# EAGLE schematic SuperLongboard-Lite 1.3.0 (EAGLE 9.7.0), part 1 of 2

## Sheet 1 of 12: MCU
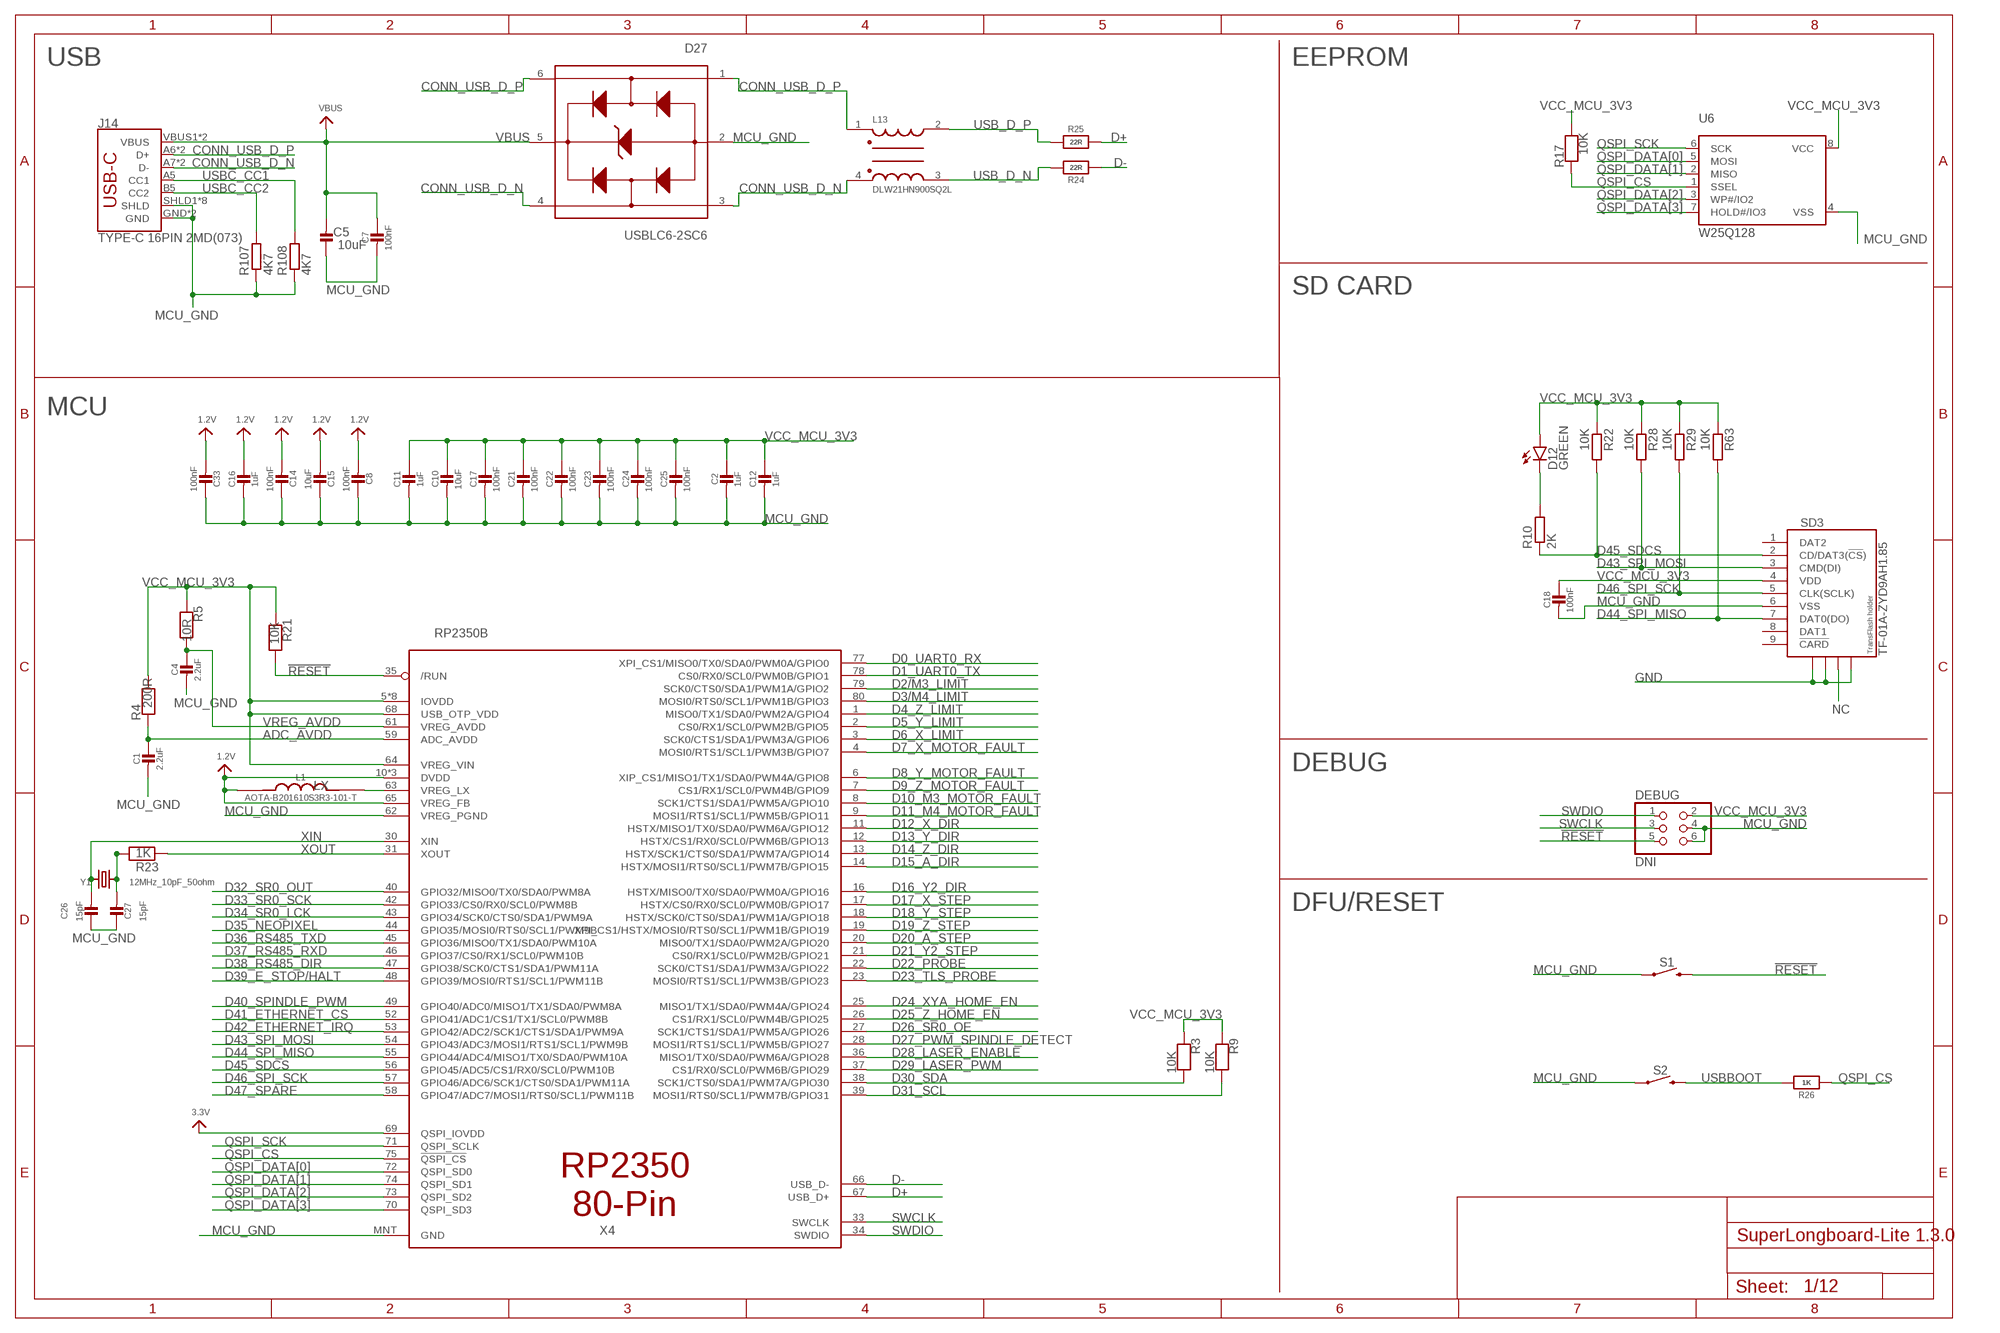
[diagram p0: schematic, sheet 1]

### Parts
C1  2.2uF  CAP_CERAMIC0603_NO  [0603-NO]
C2  1uF  CAP_CERAMIC0603_NO  [0603-NO]
C4  2.2uF  CAP_CERAMIC0603_NO  [0603-NO]
C5  10uF  CAP_CERAMIC_1206  [_1206]
C7  100nF  CAP_CERAMIC0603_NO  [0603-NO]
C8  100nF  CAP_CERAMIC0603_NO  [0603-NO]
C10  10uF  CAP_CERAMIC_1206  [_1206]
C11  1uF  CAP_CERAMIC0603_NO  [0603-NO]
C12  1uF  CAP_CERAMIC0603_NO  [0603-NO]
C14  100nF  CAP_CERAMIC0603_NO  [0603-NO]
C15  10uF  CAP_CERAMIC_1206  [_1206]
C16  1uF  CAP_CERAMIC0603_NO  [0603-NO]
C17  100nF  CAP_CERAMIC0603_NO  [0603-NO]
C18  100nF  CAP_CERAMIC0603_NO  [0603-NO]
C21  100nF  CAP_CERAMIC0603_NO  [0603-NO]
C22  100nF  CAP_CERAMIC0603_NO  [0603-NO]
C23  100nF  CAP_CERAMIC0603_NO  [0603-NO]
C24  100nF  CAP_CERAMIC0603_NO  [0603-NO]
C25  100nF  CAP_CERAMIC0603_NO  [0603-NO]
C26  15pF  CAP_CERAMIC0603_NO  [0603-NO]
C27  15pF  CAP_CERAMIC0603_NO  [0603-NO]
C33  100nF  CAP_CERAMIC0603_NO  [0603-NO]
D12  GREEN  LEDCHIP-LED0805  [CHIP-LED0805]
D27  USBLC6-2SC6  [SOT95P280X145-6N]
DEBUG  DNI  PINHD-2X3  [2X03]
J14  TYPE-C 16PIN 2MD(073)  USB_C16PIN  [USB-C-16P]
L1  AOTA-B201610S3R3-101-T  INDUCTOR-0806  [INDUCTOR-0806]
L13  DLW21HN900SQ2L  [FIL_DLW21HN900SQ2L]
R3  10K  RESISTOR_0603_NOOUT  [0603-NO]
R4  200R  RESISTOR_0603_NOOUT  [0603-NO]
R5  10R  RESISTOR_0603_NOOUT  [0603-NO]
R9  10K  RESISTOR_0603_NOOUT  [0603-NO]
R10  2K  R-EU_R0603  [R0603]
R17  10K  RESISTOR_0603  [_0603]
R21  10K  RESISTOR_0603  [_0603]
R22  10K  R-EU_R0603  [R0603]
R23  1K  RESISTOR_0603  [_0603]
R24  22R  RESISTOR_0603_NOOUT  [0603-NO]
R25  22R  RESISTOR_0603_NOOUT  [0603-NO]
R26  1K  RESISTOR_0603  [_0603]
R28  10K  R-EU_R0603  [R0603]
R29  10K  R-EU_R0603  [R0603]
R63  10K  R-EU_R0603  [R0603]
R107  4K7  R-EU_R0603  [R0603]
R108  4K7  R-EU_R0603  [R0603]
S1  ZX-QC36-4.3TPWD  MOMENTARY-SWITCH-SPST-SMD-6.0X3.5MM  [TACTILE_SWITCH_SMD_6.0X3.5MM]
S2  ZX-QC36-4.3TPWD  MOMENTARY-SWITCH-SPST-SMD-6.0X3.5MM  [TACTILE_SWITCH_SMD_6.0X3.5MM]
SD3  TF-01A-ZYD9AH1.85  TF-HOLDER  [TF-PULL]
U6  W25Q128  SPIFLASH_8PIN208MIL  [SOIC8_208MIL]
X4  RP2350B  [QFN80]
Y1  12MHz_10pF_50ohm  CRYSTAL3.2X2.5  [CRYSTAL_3.2X2.5]

### Nets
1.2V: C8.2 C14.2 C15.2 C16.1 C33.2 L1.1 X4.10(DVDD) X4.32(DVDD) X4.51(DVDD) X4.65(VREG_FB)
!RESET: DEBUG.5 R21.2 S1.2 X4.35(/RUN)
ADC_AVDD: C1.1 R4.1 X4.59(ADC_AVDD)
CONN_USB_D_N: D27.3(I/O2_IN) D27.4(I/O2_OUT) J14.A7(D-) J14.B7(D-) L13.4
CONN_USB_D_P: D27.1(I/O1_IN) D27.6(I/O1_OUT) J14.A6(D+) J14.B6(D+) L13.1
D0_UART0_RX: X4.77(XPI_CS1/MISO0/TX0/SDA0/PWM0A/GPIO0) ; also sheet 11
D1_UART0_TX: X4.78(CS0/RX0/SCL0/PWM0B/GPIO1) ; also sheet 11
D2/M3_LIMIT: X4.79(SCK0/CTS0/SDA1/PWM1A/GPIO2) ; also sheet 4
D3/M4_LIMIT: X4.80(MOSI0/RTS0/SCL1/PWM1B/GPIO3) ; also sheet 4
D4_Z_LIMIT: X4.1(MISO0/TX1/SDA0/PWM2A/GPIO4) ; also sheet 4
D5_Y_LIMIT: X4.2(CS0/RX1/SCL0/PWM2B/GPIO5) ; also sheet 4
D6_X_LIMIT: X4.3(SCK0/CTS1/SDA1/PWM3A/GPIO6) ; also sheet 4
D7_X_MOTOR_FAULT: X4.4(MOSI0/RTS1/SCL1/PWM3B/GPIO7) ; also sheet 3
D8_Y_MOTOR_FAULT: X4.6(XIP_CS1/MISO1/TX1/SDA0/PWM4A/GPIO8) ; also sheet 3
D9_Z_MOTOR_FAULT: X4.7(CS1/RX1/SCL0/PWM4B/GPIO9) ; also sheet 3
D10_M3_MOTOR_FAULT: X4.8(SCK1/CTS1/SDA1/PWM5A/GPIO10) ; also sheet 3
D11_M4_MOTOR_FAULT: X4.9(MOSI1/RTS1/SCL1/PWM5B/GPIO11) ; also sheet 3
D12_X_DIR: X4.11(HSTX/MISO1/TX0/SDA0/PWM6A/GPIO12) ; also sheet 2
D13_Y_DIR: X4.12(HSTX/CS1/RX0/SCL0/PWM6B/GPIO13) ; also sheet 2
D14_Z_DIR: X4.13(HSTX/SCK1/CTS0/SDA1/PWM7A/GPIO14) ; also sheet 2
D15_A_DIR: X4.14(HSTX/MOSI1/RTS0/SCL1/PWM7B/GPIO15) ; also sheet 2
D16_Y2_DIR: X4.16(HSTX/MISO0/TX0/SDA0/PWM0A/GPIO16) ; also sheet 2
D17_X_STEP: X4.17(HSTX/CS0/RX0/SCL0/PWM0B/GPIO17) ; also sheet 2
D18_Y_STEP: X4.18(HSTX/SCK0/CTS0/SDA1/PWM1A/GPIO18) ; also sheet 2
D19_Z_STEP: X4.19(XPI_CS1/HSTX/MOSI0/RTS0/SCL1/PWM1B/GPIO19) ; also sheet 2
D20_A_STEP: X4.20(MISO0/TX1/SDA0/PWM2A/GPIO20) ; also sheet 2
D21_Y2_STEP: X4.21(CS0/RX1/SCL0/PWM2B/GPIO21) ; also sheet 2
D22_PROBE: X4.22(SCK0/CTS1/SDA1/PWM3A/GPIO22) ; also sheet 4
D23_TLS_PROBE: X4.23(MOSI0/RTS1/SCL1/PWM3B/GPIO23) ; also sheet 4
D24_XYA_HOME_EN: X4.25(MISO1/TX1/SDA0/PWM4A/GPIO24) ; also sheet 12
D25_Z_HOME_EN: X4.26(CS1/RX1/SCL0/PWM4B/GPIO25) ; also sheet 12
D26_SR0_OE: X4.27(SCK1/CTS1/SDA1/PWM5A/GPIO26) ; also sheet 11
D27_PWM_SPINDLE_DETECT: X4.28(MOSI1/RTS1/SCL1/PWM5B/GPIO27) ; also sheet 5
D28_LASER_ENABLE: X4.36(MISO1/TX0/SDA0/PWM6A/GPIO28) ; also sheet 9
D29_LASER_PWM: X4.37(CS1/RX0/SCL0/PWM6B/GPIO29) ; also sheet 5
D30_SDA: R3.2 X4.38(SCK1/CTS0/SDA1/PWM7A/GPIO30) ; also sheet 11
D31_SCL: R9.2 X4.39(MOSI1/RTS0/SCL1/PWM7B/GPIO31) ; also sheet 11
D32_SR0_OUT: X4.40(GPIO32/MISO0/TX0/SDA0/PWM8A) ; also sheet 11
D33_SR0_SCK: X4.42(GPIO33/CS0/RX0/SCL0/PWM8B) ; also sheet 11
D34_SR0_LCK: X4.43(GPIO34/SCK0/CTS0/SDA1/PWM9A) ; also sheet 11
D35_NEOPIXEL: X4.44(GPIO35/MOSI0/RTS0/SCL1/PWM9B) ; also sheet 3,11
D36_RS485_TXD: X4.45(GPIO36/MISO0/TX1/SDA0/PWM10A) ; also sheet 6
D37_RS485_RXD: X4.46(GPIO37/CS0/RX1/SCL0/PWM10B) ; also sheet 6
D38_RS485_DIR: X4.47(GPIO38/SCK0/CTS1/SDA1/PWM11A) ; also sheet 6
D39_E_STOP/HALT: X4.48(GPIO39/MOSI0/RTS1/SCL1/PWM11B) ; also sheet 9
D40_SPINDLE_PWM: X4.49(GPIO40/ADC0/MISO1/TX1/SDA0/PWM8A) ; also sheet 5
D41_ETHERNET_CS: X4.52(GPIO41/ADC1/CS1/TX1/SCL0/PWM8B) ; also sheet 11
D42_ETHERNET_IRQ: X4.53(GPIO42/ADC2/SCK1/CTS1/SDA1/PWM9A) ; also sheet 11
D43_SPI_MOSI: R28.2 SD3.3(CMD(DI)) X4.54(GPIO43/ADC3/MOSI1/RTS1/SCL1/PWM9B) ; also sheet 11
D44_SPI_MISO: R63.2 SD3.7(DAT0(DO)) X4.55(GPIO44/ADC4/MISO1/TX0/SDA0/PWM10A) ; also sheet 11
D45_SDCS: R10.1 R22.2 SD3.2(CD/DAT3(!CS!)) X4.56(GPIO45/ADC5/CS1/RX0/SCL0/PWM10B)
D46_SPI_SCK: R29.2 SD3.5(CLK(SCLK)) X4.57(GPIO46/ADC6/SCK1/CTS0/SDA1/PWM11A) ; also sheet 11
D47_SPARE: X4.58(GPIO47/ADC7/MOSI1/RTS0/SCL1/PWM11B) ; also sheet 11
D+: R25.2 X4.67(USB_D+)
D-: R24.2 X4.66(USB_D-)
GND: SD3.S1 SD3.S2 SD3.S4 ; also sheet 2,3,4,6,7,8,9,10,11,12
LX: L1.2 X4.63(VREG_LX)
MCU_GND: C1.2 C2.2 C4.2 C5.1 C7.2 C8.1 C10.2 C11.2 C12.2 C14.1 C15.1 C16.2 C17.2 C18.2 C21.2 C22.2 C23.2 C24.2 C25.2 C26.1 C27.1 C33.1 D27.2(GND) DEBUG.4 DEBUG.6 J14.GND J14.GND2(GND) J14.SHLD1(SHLD) J14.SHLD2(SHLD) J14.SHLD3(SHLD) J14.SHLD4(SHLD) J14.SHLD5(SHLD) J14.SHLD6(SHLD) J14.SHLD7(SHLD) J14.SHLD8(SHLD) R107.1 R108.1 S1.1 S2.1 SD3.6(VSS) U6.4(VSS) X4.62(VREG_PGND) X4.MNT(GND) ; also sheet 2,3,4,5,6,7,8,9,11,12
N$8: D12.C R10.2
N$10: C27.2 R23.1 Y1.2
NC: SD3.S3
QSPI_CS: R17.1 R26.1 U6.1(SSEL) X4.75(!QSPI_CS)
QSPI_DATA[0]: U6.5(MOSI) X4.72(QSPI_SD0)
QSPI_DATA[1]: U6.2(MISO) X4.74(QSPI_SD1)
QSPI_DATA[2]: U6.3(WP#/IO2) X4.73(QSPI_SD2)
QSPI_DATA[3]: U6.7(HOLD#/IO3) X4.70(QSPI_SD3)
QSPI_SCK: U6.6(SCK) X4.71(QSPI_SCLK)
SWCLK: DEBUG.3 X4.33(SWCLK)
SWDIO: DEBUG.1 X4.34(SWDIO)
USB_D_N: L13.3 R24.1
USB_D_P: L13.2 R25.1
USBBOOT: R26.2 S2.2
USBC_CC1: J14.A5(CC1) R108.2
USBC_CC2: J14.B5(CC2) R107.2
VBUS: C5.2 C7.1 D27.5(VBUS) J14.VBUS1(VBUS) J14.VBUS2(VBUS) ; also sheet 8
VCC_MCU_3V3: C2.1 C10.1 C11.1 C12.1 C17.1 C18.1 C21.1 C22.1 C23.1 C24.1 C25.1 D12.A DEBUG.2 R3.1 R4.2 R5.1 R9.1 R17.2 R21.1 R22.1 R28.1 R29.1 R63.1 SD3.4(VDD) U6.8(VCC) X4.5(IOVDD) X4.15(IOVDD) X4.24(IOVDD) X4.29(IOVDD) X4.41(IOVDD) X4.50(IOVDD) X4.60(IOVDD) X4.64(VREG_VIN) X4.68(USB_OTP_VDD) X4.69(QSPI_IOVDD) X4.76(IOVDD) ; supply symbol labelled 3.3V ; also sheet 2,3,4,5,6,7,8,9,11,12
VREG_AVDD: C4.1 R5.2 X4.61(VREG_AVDD)
XIN: C26.2 X4.30(XIN) Y1.1
XOUT: R23.2 X4.31(XOUT)
Unconnected: SD3.1(DAT2) SD3.8(DAT1) SD3.9(!CARD)

### Notes on the sheet
- USB | EEPROM
- SD CARD
- MCU
- DEBUG
- DFU/RESET

## Sheet 2 of 12: MOTOR BUFFERS
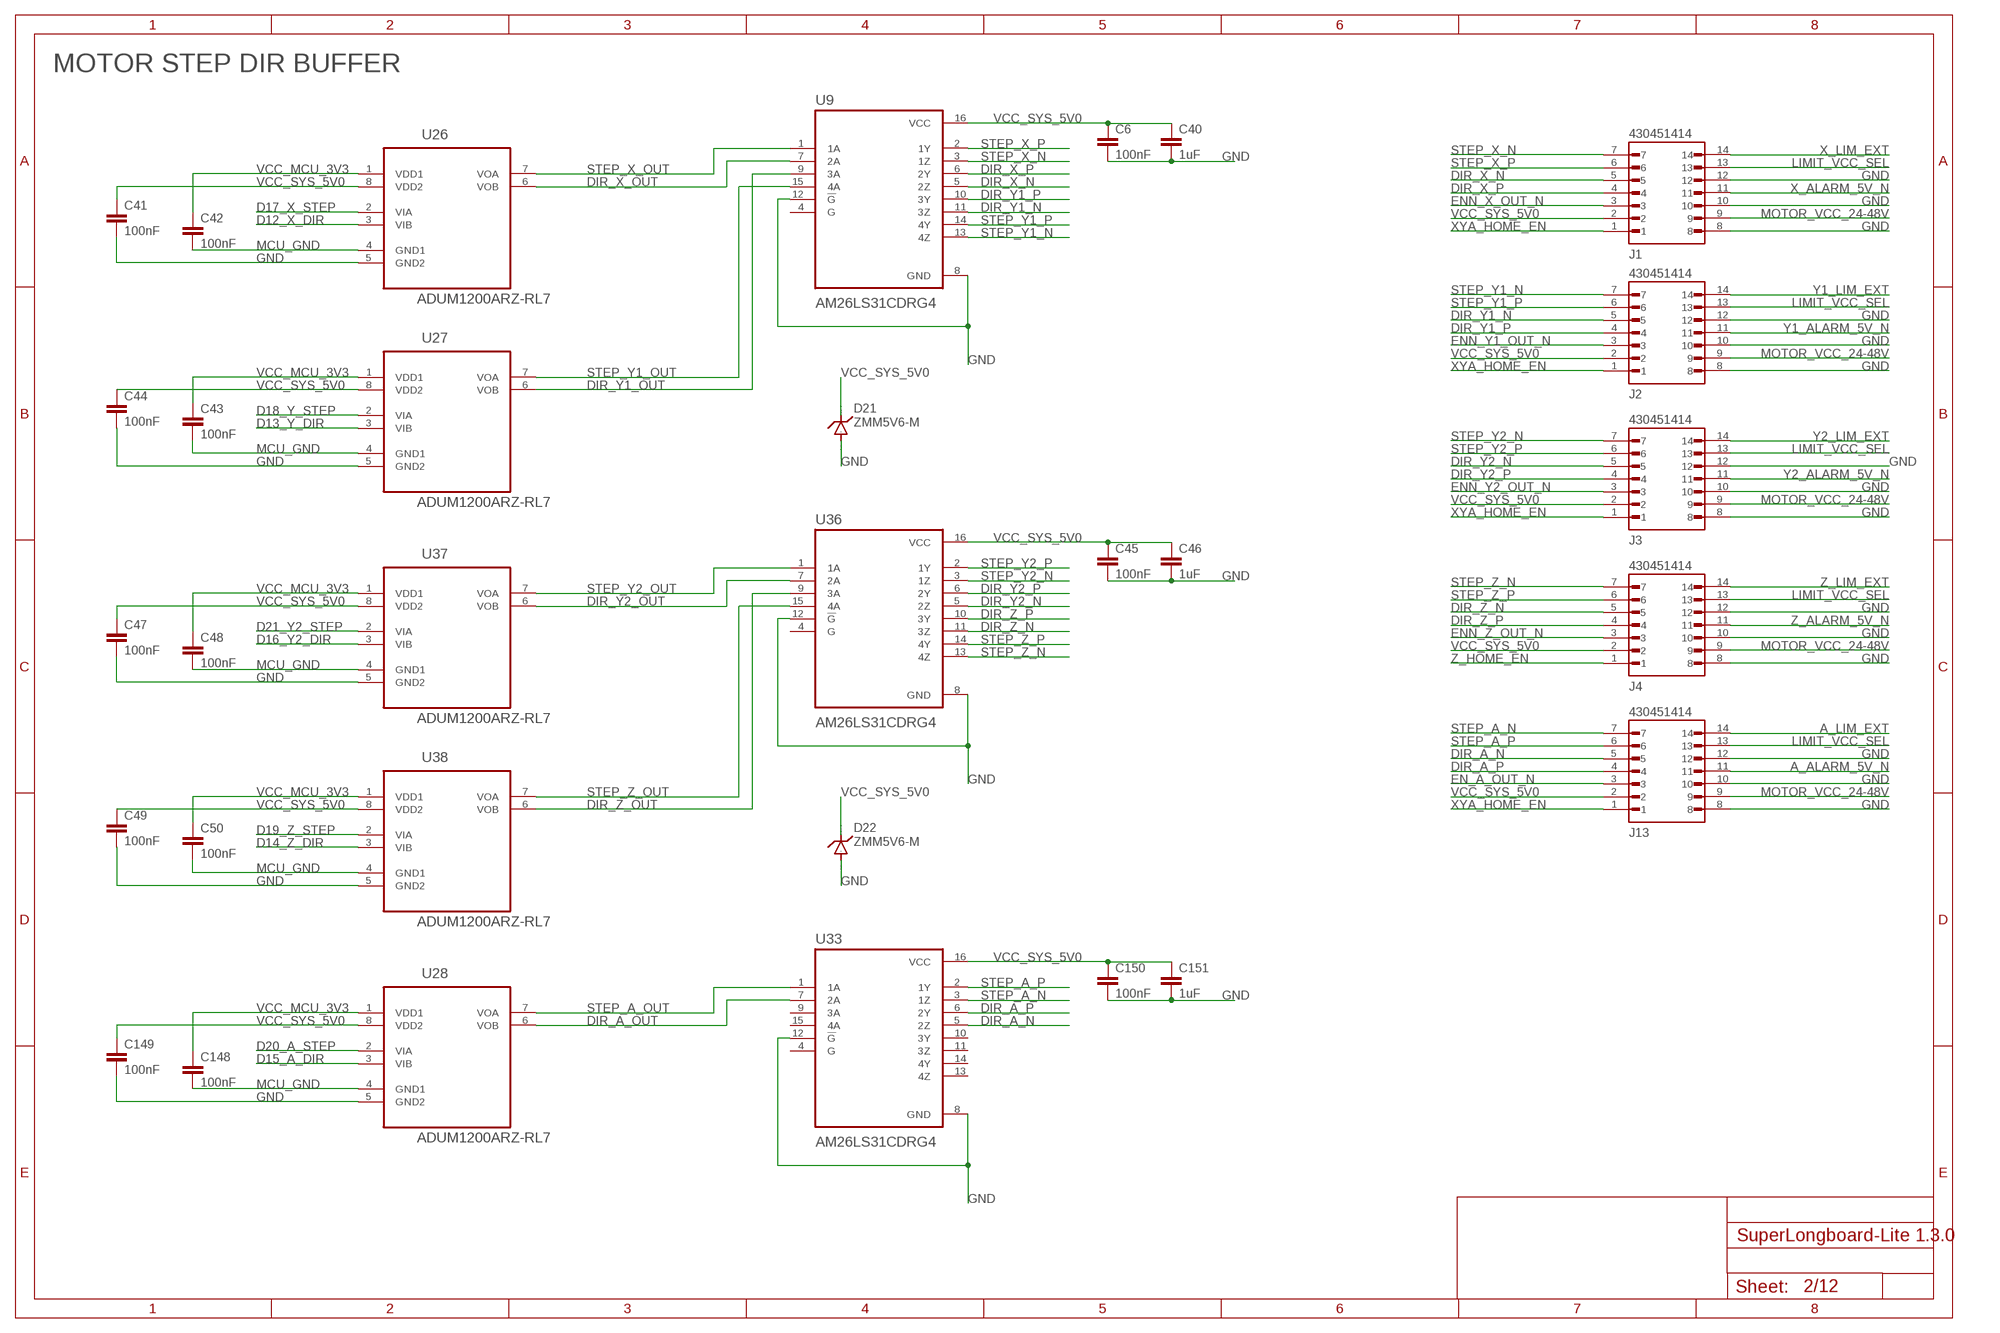
[diagram p1: schematic, sheet 2]

### Parts
C6  100nF  C-EUC0603K  [C0603K]
C40  1uF  C-EUC0603K  [C0603K]
C41  100nF  C-EUC0603K  [C0603K]
C42  100nF  C-EUC0603K  [C0603K]
C43  100nF  C-EUC0603K  [C0603K]
C44  100nF  C-EUC0603K  [C0603K]
C45  100nF  C-EUC0603K  [C0603K]
C46  1uF  C-EUC0603K  [C0603K]
C47  100nF  C-EUC0603K  [C0603K]
C48  100nF  C-EUC0603K  [C0603K]
C49  100nF  C-EUC0603K  [C0603K]
C50  100nF  C-EUC0603K  [C0603K]
C148  100nF  C-EUC0603K  [C0603K]
C149  100nF  C-EUC0603K  [C0603K]
C150  100nF  C-EUC0603K  [C0603K]
C151  1uF  C-EUC0603K  [C0603K]
D21  ZMM5V6-M  DIODE-MINIMELF  [MINIMELF]
D22  ZMM5V6-M  DIODE-MINIMELF  [MINIMELF]
J1  430451414  [MOLEX_430451414]
J2  430451414  [MOLEX_430451414]
J3  430451414  [MOLEX_430451414]
J4  430451414  [MOLEX_430451414]
J13  430451414  [MOLEX_430451414]
U9  AM26LS31CDRG4  AM26LS31CDR  [SOIC127P600X175-16N]
U26  ADUM1200ARZ-RL7  [SOIC127P600X175-8N]
U27  ADUM1200ARZ-RL7  [SOIC127P600X175-8N]
U28  ADUM1200ARZ-RL7  [SOIC127P600X175-8N]
U33  AM26LS31CDRG4  AM26LS31CDR  [SOIC127P600X175-16N]
U36  AM26LS31CDRG4  AM26LS31CDR  [SOIC127P600X175-16N]
U37  ADUM1200ARZ-RL7  [SOIC127P600X175-8N]
U38  ADUM1200ARZ-RL7  [SOIC127P600X175-8N]

### Nets
A_ALARM_5V_N: J13.11 ; also sheet 3
A_LIM_EXT: J13.14 ; also sheet 4
D12_X_DIR: U26.3(VIB) ; also sheet 1
D13_Y_DIR: U27.3(VIB) ; also sheet 1
D14_Z_DIR: U38.3(VIB) ; also sheet 1
D15_A_DIR: U28.3(VIB) ; also sheet 1
D16_Y2_DIR: U37.3(VIB) ; also sheet 1
D17_X_STEP: U26.2(VIA) ; also sheet 1
D18_Y_STEP: U27.2(VIA) ; also sheet 1
D19_Z_STEP: U38.2(VIA) ; also sheet 1
D20_A_STEP: U28.2(VIA) ; also sheet 1
D21_Y2_STEP: U37.2(VIA) ; also sheet 1
DIR_A_N: J13.5 U33.5(2Z)
DIR_A_OUT: U28.6(VOB) U33.7(2A)
DIR_A_P: J13.4 U33.6(2Y)
DIR_X_N: J1.5 U9.5(2Z)
DIR_X_OUT: U9.7(2A) U26.6(VOB)
DIR_X_P: J1.4 U9.6(2Y)
DIR_Y1_N: J2.5 U9.11(3Z)
DIR_Y1_OUT: U9.9(3A) U27.6(VOB)
DIR_Y1_P: J2.4 U9.10(3Y)
DIR_Y2_N: J3.5 U36.5(2Z)
DIR_Y2_OUT: U36.7(2A) U37.6(VOB)
DIR_Y2_P: J3.4 U36.6(2Y)
DIR_Z_N: J4.5 U36.11(3Z)
DIR_Z_OUT: U36.9(3A) U38.6(VOB)
DIR_Z_P: J4.4 U36.10(3Y)
EN_A_OUT_N: J13.3 ; also sheet 3
ENN_X_OUT_N: J1.3 ; also sheet 3
ENN_Y1_OUT_N: J2.3 ; also sheet 3
ENN_Y2_OUT_N: J3.3 ; also sheet 3
ENN_Z_OUT_N: J4.3 ; also sheet 3
GND: C6.2 C40.2 C41.2 C44.2 C45.2 C46.2 C47.2 C49.2 C149.2 C150.2 C151.2 D21.A D22.A J1.8 J1.10 J1.12 J2.8 J2.10 J2.12 J3.8 J3.10 J3.12 J4.8 J4.10 J4.12 J13.8 J13.10 J13.12 U9.8(GND) U9.12(!G) U26.5(GND2) U27.5(GND2) U28.5(GND2) U33.8(GND) U33.12(!G) U36.8(GND) U36.12(!G) U37.5(GND2) U38.5(GND2) ; also sheet 1,3,4,6,7,8,9,10,11,12
LIMIT_VCC_SEL: J1.13 J2.13 J3.13 J4.13 J13.13 ; also sheet 4
MCU_GND: C42.2 C43.2 C48.2 C50.2 C148.2 U26.4(GND1) U27.4(GND1) U28.4(GND1) U37.4(GND1) U38.4(GND1) ; also sheet 1,3,4,5,6,7,8,9,11,12
MOTOR_VCC_24-48V: J1.9 J2.9 J3.9 J4.9 J13.9 ; also sheet 4,7,8,11
STEP_A_N: J13.7 U33.3(1Z)
STEP_A_OUT: U28.7(VOA) U33.1(1A)
STEP_A_P: J13.6 U33.2(1Y)
STEP_X_N: J1.7 U9.3(1Z)
STEP_X_OUT: U9.1(1A) U26.7(VOA)
STEP_X_P: J1.6 U9.2(1Y)
STEP_Y1_N: J2.7 U9.13(4Z)
STEP_Y1_OUT: U9.15(4A) U27.7(VOA)
STEP_Y1_P: J2.6 U9.14(4Y)
STEP_Y2_N: J3.7 U36.3(1Z)
STEP_Y2_OUT: U36.1(1A) U37.7(VOA)
STEP_Y2_P: J3.6 U36.2(1Y)
STEP_Z_N: J4.7 U36.13(4Z)
STEP_Z_OUT: U36.15(4A) U38.7(VOA)
STEP_Z_P: J4.6 U36.14(4Y)
VCC_MCU_3V3: C42.1 C43.1 C48.1 C50.1 C148.1 U26.1(VDD1) U27.1(VDD1) U28.1(VDD1) U37.1(VDD1) U38.1(VDD1) ; also sheet 1,3,4,5,6,7,8,9,11,12
VCC_SYS_5V0: C6.1 C40.1 C41.1 C44.1 C45.1 C46.1 C47.1 C49.1 C149.1 C150.1 C151.1 D21.C D22.C J1.2 J2.2 J3.2 J4.2 J13.2 U9.16(VCC) U26.8(VDD2) U27.8(VDD2) U28.8(VDD2) U33.16(VCC) U36.16(VCC) U37.8(VDD2) U38.8(VDD2) ; also sheet 3,4,6,8,9,10,11,12
X_ALARM_5V_N: J1.11 ; also sheet 3
X_LIM_EXT: J1.14 ; also sheet 4
XYA_HOME_EN: J1.1 J2.1 J3.1 J13.1 ; also sheet 12
Y1_ALARM_5V_N: J2.11 ; also sheet 3
Y1_LIM_EXT: J2.14 ; also sheet 4
Y2_ALARM_5V_N: J3.11 ; also sheet 3
Y2_LIM_EXT: J3.14 ; also sheet 4
Z_ALARM_5V_N: J4.11 ; also sheet 3
Z_HOME_EN: J4.1 ; also sheet 12
Z_LIM_EXT: J4.14 ; also sheet 4
Unconnected: U9.4(G) U33.4(G) U33.9(3A) U33.10(3Y) U33.11(3Z) U33.13(4Z) U33.14(4Y) U33.15(4A) U36.4(G)

### Notes on the sheet
- MOTOR STEP DIR BUFFER

## Sheet 3 of 12: MOTOR BUFFERS
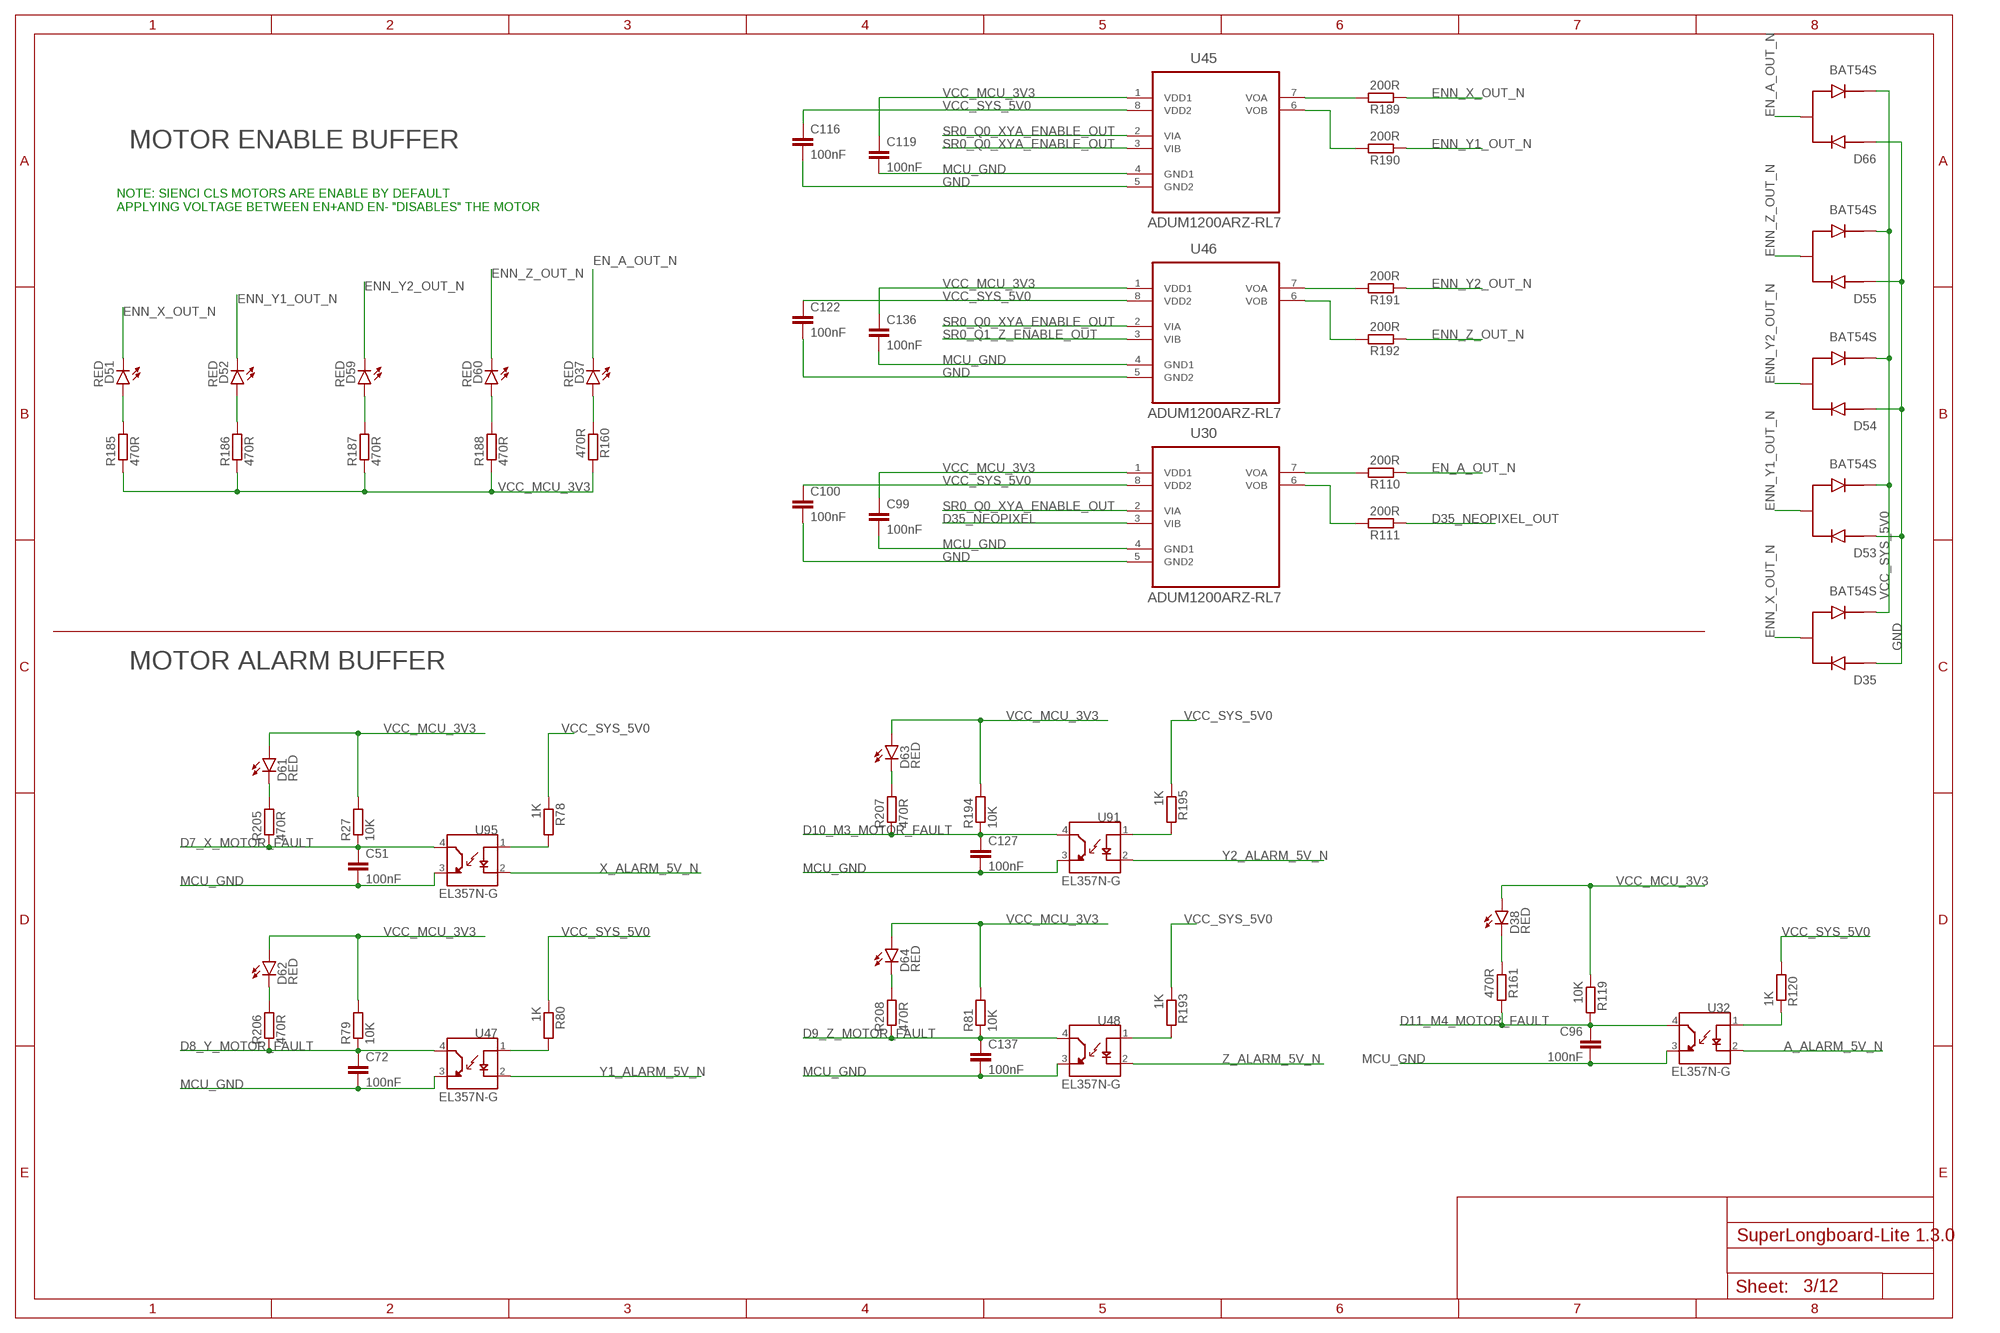
[diagram p2: schematic, sheet 3]

### Parts
C51  100nF  C-EUC0603  [C0603]
C72  100nF  C-EUC0603  [C0603]
C96  100nF  C-EUC0603  [C0603]
C99  100nF  C-EUC0603K  [C0603K]
C100  100nF  C-EUC0603K  [C0603K]
C116  100nF  C-EUC0603K  [C0603K]
C119  100nF  C-EUC0603K  [C0603K]
C122  100nF  C-EUC0603K  [C0603K]
C127  100nF  C-EUC0603  [C0603]
C136  100nF  C-EUC0603K  [C0603K]
C137  100nF  C-EUC0603  [C0603]
D35  BAT54S  [SOT95P240X120-3N]
D37  RED  LEDCHIP-LED0805  [CHIP-LED0805]
D38  RED  LEDCHIP-LED0805  [CHIP-LED0805]
D51  RED  LEDCHIP-LED0805  [CHIP-LED0805]
D52  RED  LEDCHIP-LED0805  [CHIP-LED0805]
D53  BAT54S  [SOT95P240X120-3N]
D54  BAT54S  [SOT95P240X120-3N]
D55  BAT54S  [SOT95P240X120-3N]
D59  RED  LEDCHIP-LED0805  [CHIP-LED0805]
D60  RED  LEDCHIP-LED0805  [CHIP-LED0805]
D61  RED  LEDCHIP-LED0805  [CHIP-LED0805]
D62  RED  LEDCHIP-LED0805  [CHIP-LED0805]
D63  RED  LEDCHIP-LED0805  [CHIP-LED0805]
D64  RED  LEDCHIP-LED0805  [CHIP-LED0805]
D66  BAT54S  [SOT95P240X120-3N]
R27  10K  R-EU_R0603  [R0603]
R78  1K  R-EU_R0603  [R0603]
R79  10K  R-EU_R0603  [R0603]
R80  1K  R-EU_R0603  [R0603]
R81  10K  R-EU_R0603  [R0603]
R110  200R  R-EU_R0603  [R0603]
R111  200R  R-EU_R0603  [R0603]
R119  10K  R-EU_R0603  [R0603]
R120  1K  R-EU_R0603  [R0603]
R160  470R  R-EU_R0603  [R0603]
R161  470R  R-EU_R0603  [R0603]
R185  470R  R-EU_R0603  [R0603]
R186  470R  R-EU_R0603  [R0603]
R187  470R  R-EU_R0603  [R0603]
R188  470R  R-EU_R0603  [R0603]
R189  200R  R-EU_R0603  [R0603]
R190  200R  R-EU_R0603  [R0603]
R191  200R  R-EU_R0603  [R0603]
R192  200R  R-EU_R0603  [R0603]
R193  1K  R-EU_R0603  [R0603]
R194  10K  R-EU_R0603  [R0603]
R195  1K  R-EU_R0603  [R0603]
R205  470R  R-EU_R0603  [R0603]
R206  470R  R-EU_R0603  [R0603]
R207  470R  R-EU_R0603  [R0603]
R208  470R  R-EU_R0603  [R0603]
U30  ADUM1200ARZ-RL7  [SOIC127P600X175-8N]
U32  EL357N-G  [OPTO_EL357N-G]
U45  ADUM1200ARZ-RL7  [SOIC127P600X175-8N]
U46  ADUM1200ARZ-RL7  [SOIC127P600X175-8N]
U47  EL357N-G  [OPTO_EL357N-G]
U48  EL357N-G  [OPTO_EL357N-G]
U91  EL357N-G  [OPTO_EL357N-G]
U95  EL357N-G  [OPTO_EL357N-G]

### Nets
A_ALARM_5V_N: U32.2(C) ; also sheet 2
D7_X_MOTOR_FAULT: C51.1 R27.1 R205.1 U95.4(CT) ; also sheet 1
D8_Y_MOTOR_FAULT: C72.1 R79.1 R206.1 U47.4(CT) ; also sheet 1
D9_Z_MOTOR_FAULT: C137.1 R81.1 R208.1 U48.4(CT) ; also sheet 1
D10_M3_MOTOR_FAULT: C127.1 R194.1 R207.1 U91.4(CT) ; also sheet 1
D11_M4_MOTOR_FAULT: C96.1 R119.2 R161.2 U32.4(CT) ; also sheet 1
D35_NEOPIXEL: U30.3(VIB) ; also sheet 1,11
D35_NEOPIXEL_OUT: R111.1 ; also sheet 10
EN_A_OUT_N: D37.C D66.3 R110.1 ; also sheet 2
ENN_X_OUT_N: D35.3 D51.C R189.1 ; also sheet 2
ENN_Y1_OUT_N: D52.C D53.3 R190.1 ; also sheet 2
ENN_Y2_OUT_N: D54.3 D59.C R191.1 ; also sheet 2
ENN_Z_OUT_N: D55.3 D60.C R192.1 ; also sheet 2
GND: C100.2 C116.2 C122.2 D35.1 D53.1 D54.1 D55.1 D66.1 U30.5(GND2) U45.5(GND2) U46.5(GND2) ; also sheet 1,2,4,6,7,8,9,10,11,12
MCU_GND: C51.2 C72.2 C96.2 C99.2 C119.2 C127.2 C136.2 C137.2 U30.4(GND1) U32.3(ET) U45.4(GND1) U46.4(GND1) U47.3(ET) U48.3(ET) U91.3(ET) U95.3(ET) ; also sheet 1,2,4,5,6,7,8,9,11,12
N$1: R189.2 U45.7(VOA)
N$3: R190.2 U45.6(VOB)
N$4: R191.2 U46.7(VOA)
N$5: R192.2 U46.6(VOB)
N$7: D62.C R206.2
N$9: R78.2 U95.1(A)
N$11: D61.C R205.2
N$12: R80.2 U47.1(A)
N$13: D63.C R207.2
N$14: R195.2 U91.1(A)
N$15: D64.C R208.2
N$16: R193.2 U48.1(A)
N$17: D51.A R185.2
N$18: D52.A R186.2
N$21: D37.A R160.1
N$23: D60.A R188.2
N$24: D59.A R187.2
N$66: R110.2 U30.7(VOA)
N$69: R111.2 U30.6(VOB)
N$72: R120.1 U32.1(A)
N$92: D38.C R161.1
SR0_Q0_XYA_ENABLE_OUT: U30.2(VIA) U45.2(VIA) U45.3(VIB) U46.2(VIA) ; also sheet 9
SR0_Q1_Z_ENABLE_OUT: U46.3(VIB) ; also sheet 9
VCC_MCU_3V3: C99.1 C119.1 C136.1 D38.A D61.A D62.A D63.A D64.A R27.2 R79.2 R81.2 R119.1 R160.2 R185.1 R186.1 R187.1 R188.1 R194.2 U30.1(VDD1) U45.1(VDD1) U46.1(VDD1) ; also sheet 1,2,4,5,6,7,8,9,11,12
VCC_SYS_5V0: C100.1 C116.1 C122.1 D35.2 D53.2 D54.2 D55.2 D66.2 R78.1 R80.1 R120.2 R193.1 R195.1 U30.8(VDD2) U45.8(VDD2) U46.8(VDD2) ; also sheet 2,4,6,8,9,10,11,12
X_ALARM_5V_N: U95.2(C) ; also sheet 2
Y1_ALARM_5V_N: U47.2(C) ; also sheet 2
Y2_ALARM_5V_N: U91.2(C) ; also sheet 2
Z_ALARM_5V_N: U48.2(C) ; also sheet 2

### Notes on the sheet
- MOTOR ENABLE BUFFER
- NOTE: SIENCI CLS MOTORS ARE ENABLE BY DEFAULT 
  APPLYING VOLTAGE BETWEEN EN+AND EN- "DISABLES" THE MOTOR
- MOTOR ALARM BUFFER

## Sheet 4 of 12: LIMITS, PROBE, AUX
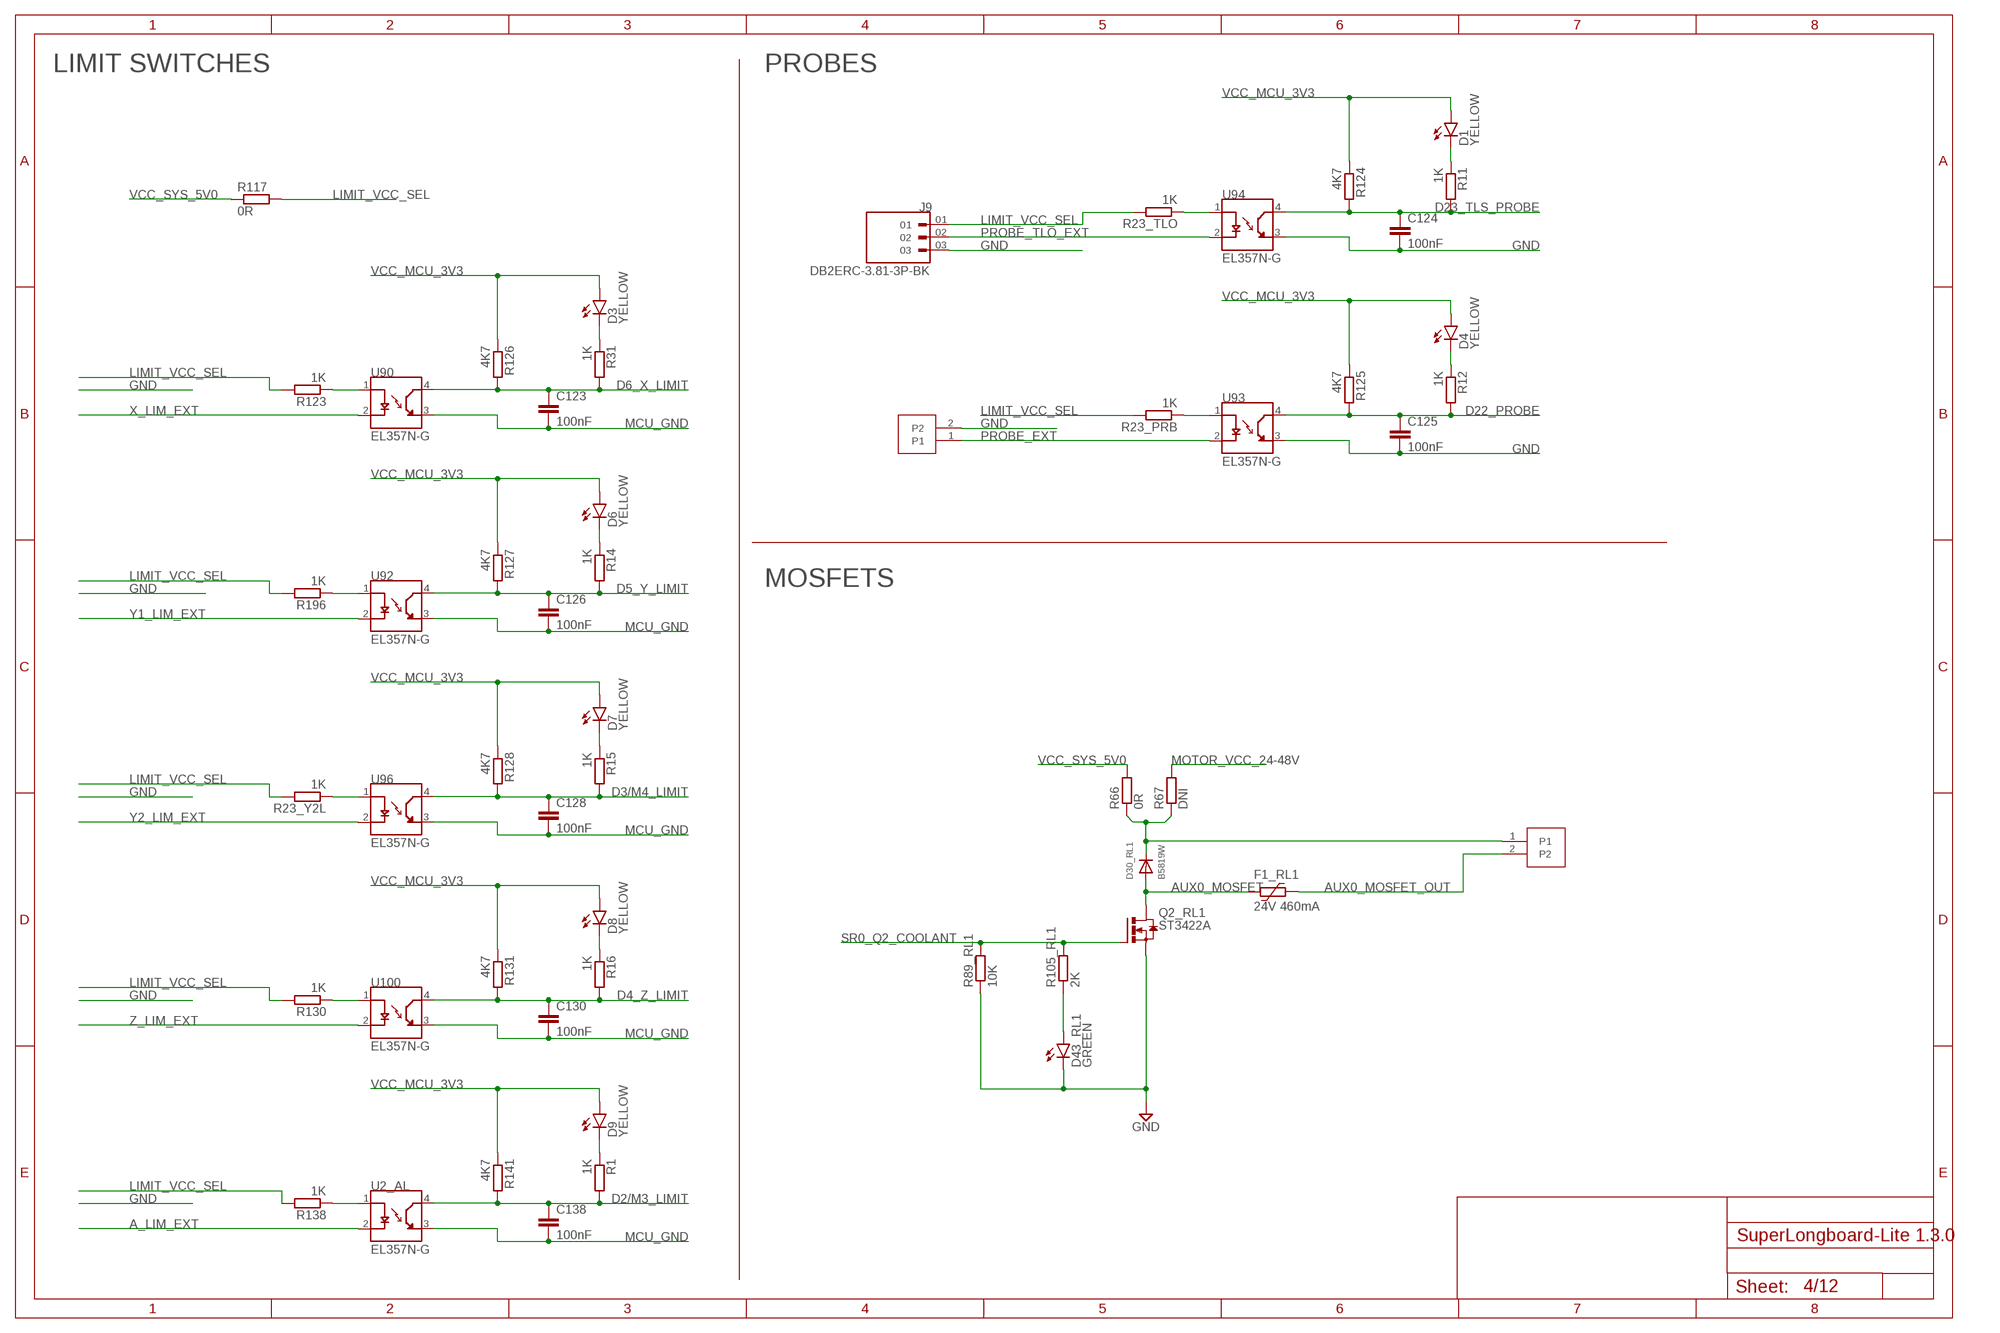
[diagram p3: schematic, sheet 4]

### Parts
C123  100nF  C-EUC0603  [C0603]
C124  100nF  C-EUC0603  [C0603]
C125  100nF  C-EUC0603  [C0603]
C126  100nF  C-EUC0603  [C0603]
C128  100nF  C-EUC0603  [C0603]
C130  100nF  C-EUC0603  [C0603]
C138  100nF  C-EUC0603  [C0603]
D1  YELLOW  LEDCHIP-LED0805  [CHIP-LED0805]
D3  YELLOW  LEDCHIP-LED0805  [CHIP-LED0805]
D4  YELLOW  LEDCHIP-LED0805  [CHIP-LED0805]
D6  YELLOW  LEDCHIP-LED0805  [CHIP-LED0805]
D7  YELLOW  LEDCHIP-LED0805  [CHIP-LED0805]
D8  YELLOW  LEDCHIP-LED0805  [CHIP-LED0805]
D9  YELLOW  LEDCHIP-LED0805  [CHIP-LED0805]
D30_RL1  B5819W  [SOD123FL]
D43_RL1  GREEN  LEDCHIP-LED0805  [CHIP-LED0805]
F1_RL1  24V 460mA  1206L050  [1206L]
J9  DB2ERC-3.81-3P-BK  1803280  [PHOENIX_1803280]
J12  DB2ERC-3.81-2P-BK  1803277  [MC1.5/2-G-3.81]
J17  DB2ERC-3.81-2P-BK  1803277  [MC1.5/2-G-3.81]
Q2_RL1  ST3422A  [SOT-23]
R1  1K  R-EU_R0603  [R0603]
R11  1K  R-EU_R0603  [R0603]
R12  1K  R-EU_R0603  [R0603]
R14  1K  R-EU_R0603  [R0603]
R15  1K  R-EU_R0603  [R0603]
R16  1K  R-EU_R0603  [R0603]
R23_PRB  1K  R-EU_R0603  [R0603]
R23_TLO  1K  R-EU_R0603  [R0603]
R23_Y2L  1K  R-EU_R0603  [R0603]
R31  1K  R-EU_R0603  [R0603]
R66  0R  R-EU_R0603  [R0603]
R67  DNI  R-EU_R0603  [R0603]
R89_RL1  10K  R-EU_R0603  [R0603]
R105_RL1  2K  R-EU_R0603  [R0603]
R117  0R  R-EU_R0603  [R0603]
R123  1K  R-EU_R0603  [R0603]
R124  4K7  R-EU_R0603  [R0603]
R125  4K7  R-EU_R0603  [R0603]
R126  4K7  R-EU_R0603  [R0603]
R127  4K7  R-EU_R0603  [R0603]
R128  4K7  R-EU_R0603  [R0603]
R130  1K  R-EU_R0603  [R0603]
R131  4K7  R-EU_R0603  [R0603]
R138  1K  R-EU_R0603  [R0603]
R141  4K7  R-EU_R0603  [R0603]
R196  1K  R-EU_R0603  [R0603]
U2_AL  EL357N-G  [OPTO_EL357N-G]
U90  EL357N-G  [OPTO_EL357N-G]
U92  EL357N-G  [OPTO_EL357N-G]
U93  EL357N-G  [OPTO_EL357N-G]
U94  EL357N-G  [OPTO_EL357N-G]
U96  EL357N-G  [OPTO_EL357N-G]
U100  EL357N-G  [OPTO_EL357N-G]

### Nets
A_LIM_EXT: U2_AL.2(C) ; also sheet 2
AUX0_MOSFET: D30_RL1.A F1_RL1.2 Q2_RL1.P3(D)
AUX0_MOSFET_OUT: F1_RL1.1 J17.2
D2/M3_LIMIT: C138.1 R1.2 R141.2 U2_AL.4(CT) ; also sheet 1
D3/M4_LIMIT: C128.1 R15.2 R128.2 U96.4(CT) ; also sheet 1
D4_Z_LIMIT: C130.1 R16.2 R131.2 U100.4(CT) ; also sheet 1
D5_Y_LIMIT: C126.1 R14.2 R127.2 U92.4(CT) ; also sheet 1
D6_X_LIMIT: C123.1 R31.2 R126.2 U90.4(CT) ; also sheet 1
D22_PROBE: C125.1 R12.2 R125.2 U93.4(CT) ; also sheet 1
D23_TLS_PROBE: C124.1 R11.2 R124.2 U94.4(CT) ; also sheet 1
GND: C124.2 C125.2 D43_RL1.C J9.03 J12.2 Q2_RL1.P2(S) R89_RL1.1 U93.3(ET) U94.3(ET) ; also sheet 1,2,3,6,7,8,9,10,11,12
LIMIT_VCC_SEL: J9.01 R23_PRB.2 R23_TLO.2 R23_Y2L.2 R117.2 R123.2 R130.2 R138.2 R196.2 ; also sheet 2
MCU_GND: C123.2 C126.2 C128.2 C130.2 C138.2 U2_AL.3(ET) U90.3(ET) U92.3(ET) U96.3(ET) U100.3(ET) ; also sheet 1,2,3,5,6,7,8,9,11,12
MOTOR_VCC_24-48V: R67.2 ; also sheet 2,7,8,11
N$39: D3.C R31.1
N$41: D30_RL1.C J17.1 R66.1 R67.1
N$42: D43_RL1.A R105_RL1.1
N$102: R23_TLO.1 U94.1(A)
N$103: D1.C R11.1
N$104: R23_PRB.1 U93.1(A)
N$105: D4.C R12.1
N$106: R123.1 U90.1(A)
N$108: R196.1 U92.1(A)
N$109: D6.C R14.1
N$110: R23_Y2L.1 U96.1(A)
N$111: D7.C R15.1
N$112: R130.1 U100.1(A)
N$113: D8.C R16.1
N$114: R138.1 U2_AL.1(A)
N$115: D9.C R1.1
PROBE_EXT: J12.1 U93.2(C)
PROBE_TLO_EXT: J9.02 U94.2(C)
SR0_Q2_COOLANT: Q2_RL1.P1(G) R89_RL1.2 R105_RL1.2 ; also sheet 11
VCC_MCU_3V3: D1.A D3.A D4.A D6.A D7.A D8.A D9.A R124.1 R125.1 R126.1 R127.1 R128.1 R131.1 R141.1 ; also sheet 1,2,3,5,6,7,8,9,11,12
VCC_SYS_5V0: R66.2 R117.1 ; also sheet 2,3,6,8,9,10,11,12
X_LIM_EXT: U90.2(C) ; also sheet 2
Y1_LIM_EXT: U92.2(C) ; also sheet 2
Y2_LIM_EXT: U96.2(C) ; also sheet 2
Z_LIM_EXT: U100.2(C) ; also sheet 2

### Notes on the sheet
- LIMIT SWITCHES | PROBES
- MOSFETS

## Sheet 5 of 12: LASER AND PWM SPINDLE
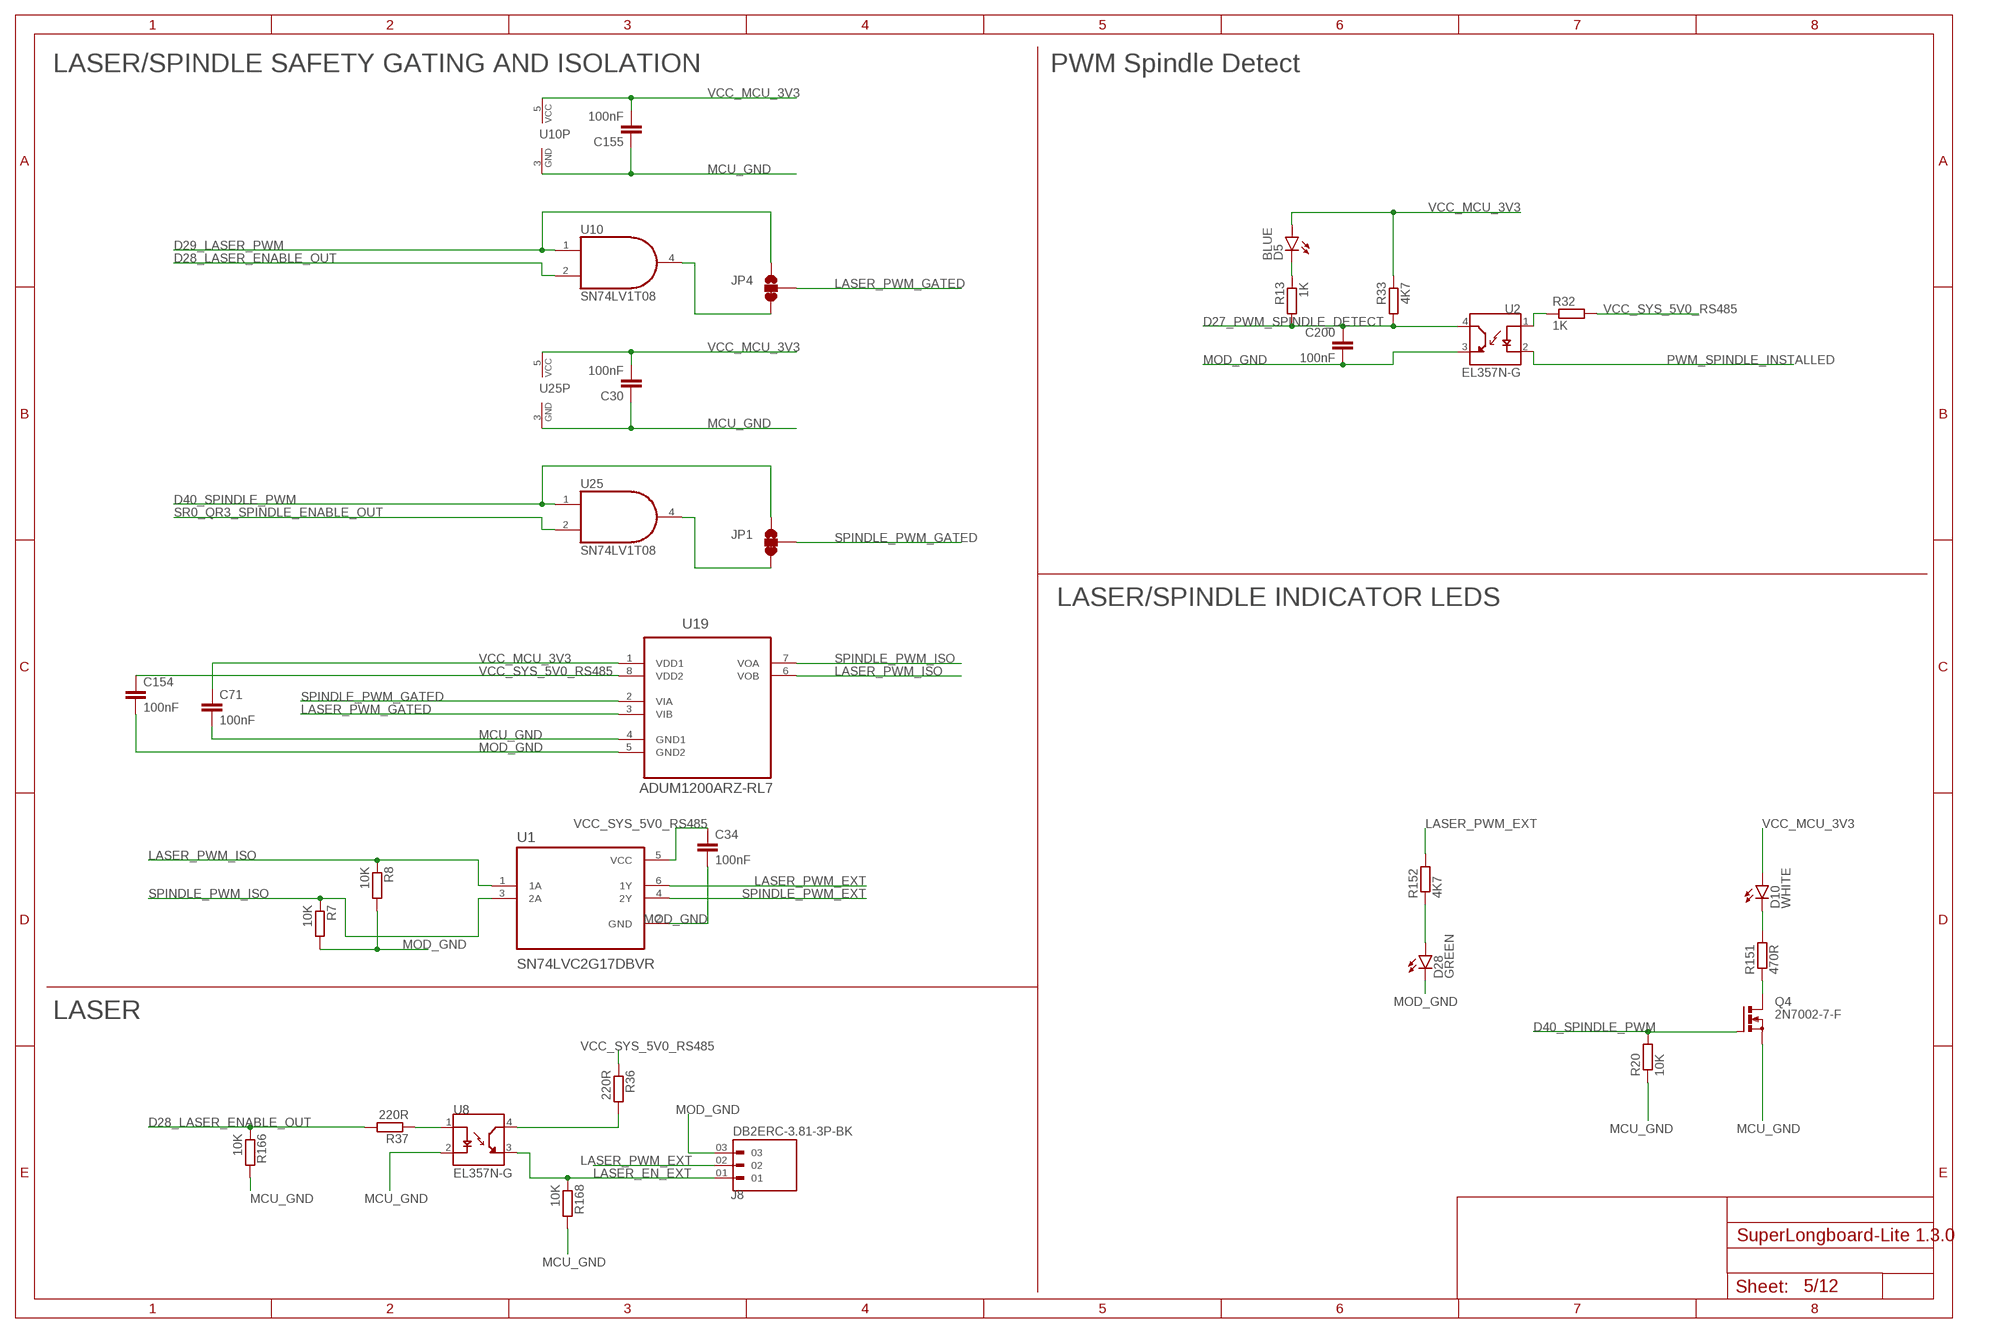
[diagram p4: schematic, sheet 5]

### Parts
C30  100nF  C-EUC0603  [C0603]
C34  100nF  C-EUC0603  [C0603]
C71  100nF  C-EUC0603K  [C0603K]
C154  100nF  C-EUC0603K  [C0603K]
C155  100nF  C-EUC0603  [C0603]
C200  100nF  C-EUC0603  [C0603]
D5  BLUE  LEDCHIP-LED0805  [CHIP-LED0805]
D10  WHITE  LEDCHIP-LED0805  [CHIP-LED0805]
D28  GREEN  LEDCHIP-LED0805  [CHIP-LED0805]
J8  DB2ERC-3.81-3P-BK  1803280  [PHOENIX_1803280]
JP1  DNI  JUMPER-SMT_3_1-NC_TRACE_SILK  [SMT-JUMPER_3_1-NC_TRACE_SILK]
JP4  DNI  JUMPER-SMT_3_1-NC_TRACE_SILK  [SMT-JUMPER_3_1-NC_TRACE_SILK]
Q4  2N7002-7-F  [SOT-23]
R7  10K  R-EU_R0603  [R0603]
R8  10K  R-EU_R0603  [R0603]
R13  1K  R-EU_R0603  [R0603]
R20  10K  R-EU_R0603  [R0603]
R32  1K  R-EU_R0603  [R0603]
R33  4K7  R-EU_R0603  [R0603]
R36  220R  R-EU_R0603  [R0603]
R37  220R  R-EU_R0603  [R0603]
R151  470R  R-EU_R0603  [R0603]
R152  4K7  R-EU_R0603  [R0603]
R166  10K  R-EU_R0603  [R0603]
R168  10K  R-EU_R0603  [R0603]
U1  SN74LVC2G17DBVR  [SOT95P280X145-6N]
U2  EL357N-G  [OPTO_EL357N-G]
U8  EL357N-G  [OPTO_EL357N-G]
U10  SN74LV1T08  74AHC1G08DBV  [SOT23-5]
U19  ADUM1200ARZ-RL7  [SOIC127P600X175-8N]
U25  SN74LV1T08  74AHC1G08DBV  [SOT23-5]

### Nets
D27_PWM_SPINDLE_DETECT: C200.1 R13.2 R33.2 U2.4(CT) ; also sheet 1
D28_LASER_ENABLE_OUT: R37.2 R166.1 U10.2(I1) ; also sheet 9
D29_LASER_PWM: JP4.1 U10.1(I0) ; also sheet 1
D40_SPINDLE_PWM: JP1.1 Q4.P1(G) R20.2 U25.1(I0) ; also sheet 1
LASER_EN_EXT: J8.01 R168.1 U8.3(ET)
LASER_PWM_EXT: J8.02 R152.2 U1.6(1Y)
LASER_PWM_GATED: JP4.2 U19.3(VIB)
LASER_PWM_ISO: R8.1 U1.1(1A) U19.6(VOB)
MCU_GND: C30.1 C71.2 C155.1 Q4.P2(S) R20.1 R166.2 R168.2 U8.2(C) U10.3(GND) U19.4(GND1) U25.3(GND) ; also sheet 1,2,3,4,6,7,8,9,11,12
MOD_GND: C34.2 C154.2 C200.2 D28.C J8.03 R7.2 R8.2 U1.2(GND) U2.3(ET) U19.5(GND2) ; also sheet 6,9
N$25: R32.1 U2.1(A)
N$29: JP1.3 U25.4(O)
N$37: D10.C R151.2
N$38: Q4.P3(D) R151.1
N$65: JP4.3 U10.4(O)
N$107: D5.C R13.1
N$172: D28.A R152.1
N$176: R37.1 U8.1(A)
N$177: R36.2 U8.4(CT)
PWM_SPINDLE_INSTALLED: U2.2(C) ; also sheet 6
SPINDLE_PWM_EXT: U1.4(2Y) ; also sheet 6
SPINDLE_PWM_GATED: JP1.2 U19.2(VIA)
SPINDLE_PWM_ISO: R7.1 U1.3(2A) U19.7(VOA)
SR0_QR3_SPINDLE_ENABLE_OUT: U25.2(I1) ; also sheet 9
VCC_MCU_3V3: C30.2 C71.1 C155.2 D5.A D10.A R33.1 U10.5(VCC) U19.1(VDD1) U25.5(VCC) ; also sheet 1,2,3,4,6,7,8,9,11,12
VCC_SYS_5V0_RS485: C34.1 C154.1 R32.2 R36.1 U1.5(VCC) U19.8(VDD2) ; also sheet 6

### Notes on the sheet
- LASER/SPINDLE SAFETY GATING AND ISOLATION | PWM Spindle Detect
- LASER/SPINDLE INDICATOR LEDS
- LASER

## Sheet 6 of 12: RS485 MODBUS
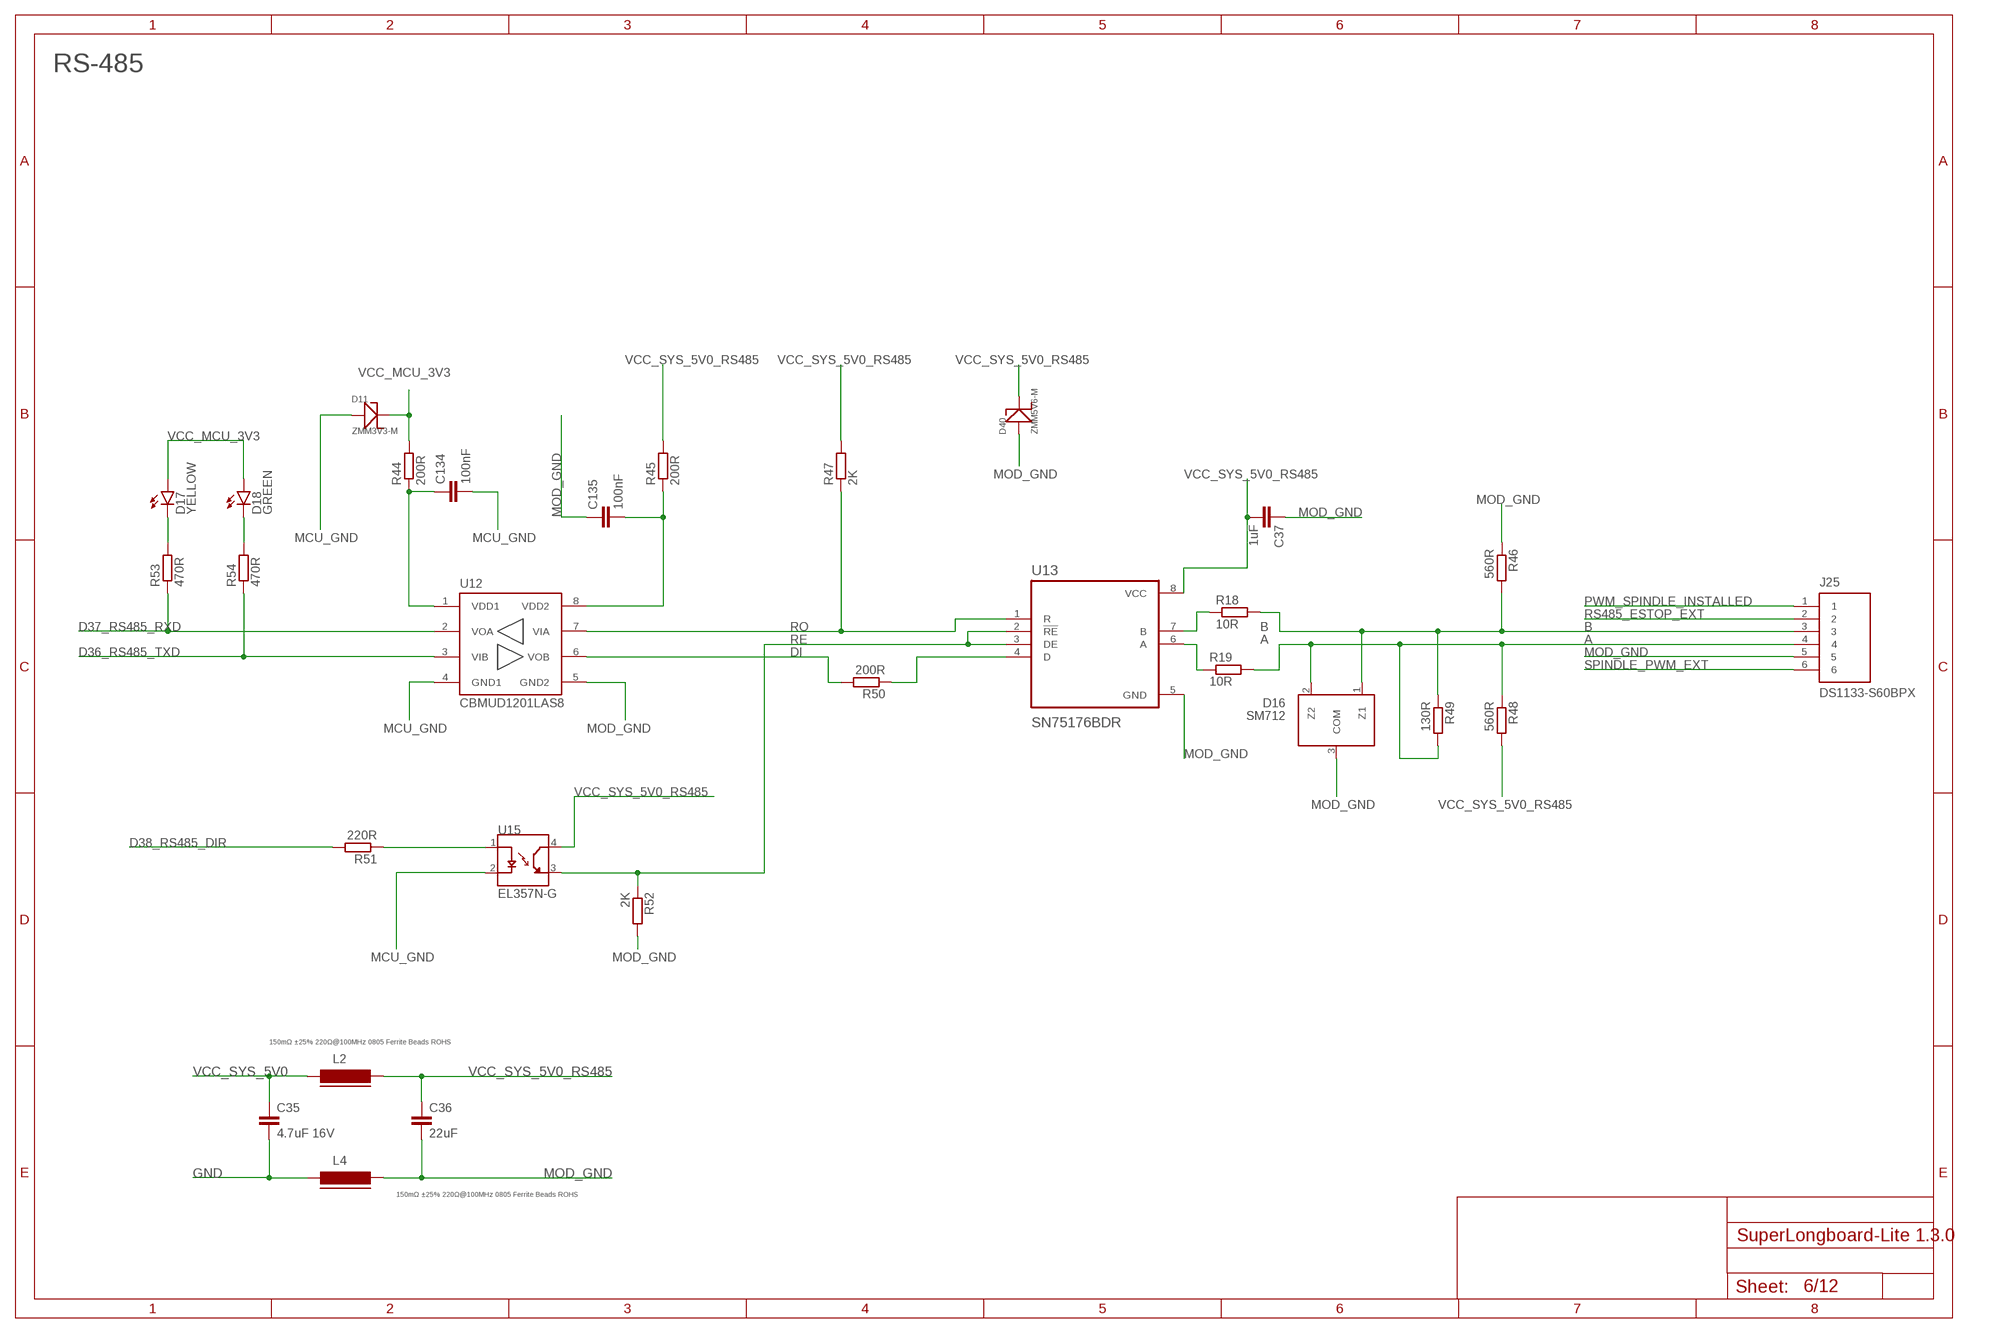
[diagram p5: schematic, sheet 6]

### Parts
C35  4.7uF 16V  C-EUC0603  [C0603]
C36  22uF  C-EUC0603  [C0603]
C37  1uF  C-EUC0603  [C0603]
C134  100nF  C-EUC0603  [C0603]
C135  100nF  C-EUC0603  [C0603]
D11  ZMM3V3-M  [LL-34]
D16  SM712  [SOT23]
D17  YELLOW  LEDCHIP-LED0805  [CHIP-LED0805]
D18  GREEN  LEDCHIP-LED0805  [CHIP-LED0805]
D40  ZMM5V6-M  ZMM3V3-M  [LL-34]
J25  DS1133-S60BPX  KH-PCB-6P6C  [KH-PCB-6P6C]
L2  150mΩ ±25% 220Ω@100MHz 0805 Ferrite Beads ROHS  FERRITE-0805  [FB805]
L4  150mΩ ±25% 220Ω@100MHz 0805 Ferrite Beads ROHS  FERRITE-0805  [FB805]
R18  10R  R-EU_R0603  [R0603]
R19  10R  R-EU_R0603  [R0603]
R44  200R  R-EU_R0603  [R0603]
R45  200R  R-EU_R0603  [R0603]
R46  560R  R-EU_R0603  [R0603]
R47  2K  R-EU_R0603  [R0603]
R48  560R  R-EU_R0603  [R0603]
R49  130R  R-EU_R0805  [R0805]
R50  200R  R-EU_R0603  [R0603]
R51  220R  R-EU_R0603  [R0603]
R52  2K  R-EU_R0603  [R0603]
R53  470R  R-EU_R0603  [R0603]
R54  470R  R-EU_R0603  [R0603]
U12  CBMUD1201LAS8  [SOIC-8]
U13  SN75176BDR  [SOIC127P599X175-8N]
U15  EL357N-G  [OPTO_EL357N-G]

### Nets
A: D16.2(Z2) J25.4 R19.2 R48.1 R49.2
B: D16.1(Z1) J25.3 R18.2 R46.2 R49.1
D36_RS485_TXD: R54.1 U12.3(VIB) ; also sheet 1
D37_RS485_RXD: R53.1 U12.2(VOA) ; also sheet 1
D38_RS485_DIR: R51.2 ; also sheet 1
DI: R50.2 U12.6(VOB)
GND: C35.2 L4.1 ; also sheet 1,2,3,4,7,8,9,10,11,12
MCU_GND: C134.2 D11.A(+) U12.4(GND1) U15.2(C) ; also sheet 1,2,3,4,5,7,8,9,11,12
MOD_GND: C36.2 C37.1 C135.1 D16.3(COM) D40.A(+) J25.5 L4.2 R46.1 R52.2 U12.5(GND2) U13.5(GND) ; also sheet 5,9
N$20: R18.1 U13.7(B)
N$40: R19.1 U13.6(A)
N$188: C134.1 R44.1 U12.1(VDD1)
N$189: C135.2 R45.1 U12.8(VDD2)
N$190: R50.1 U13.4(D)
N$192: R51.1 U15.1(A)
N$193: D17.C R53.2
N$194: D18.C R54.2
PWM_SPINDLE_INSTALLED: J25.1 ; also sheet 5
RE: R52.1 U13.2(!RE) U13.3(DE) U15.3(ET)
RO: R47.1 U12.7(VIA) U13.1(R)
RS485_ESTOP_EXT: J25.2 ; also sheet 9
SPINDLE_PWM_EXT: J25.6 ; also sheet 5
VCC_MCU_3V3: D11.C(-) D17.A D18.A R44.2 ; also sheet 1,2,3,4,5,7,8,9,11,12
VCC_SYS_5V0: C35.1 L2.1 ; also sheet 2,3,4,8,9,10,11,12
VCC_SYS_5V0_RS485: C36.1 C37.2 D40.C(-) L2.2 R45.2 R47.2 R48.2 U13.8(VCC) U15.4(CT) ; also sheet 5

### Notes on the sheet
- RS-485

## Sheet 7 of 12: POWER INPUT
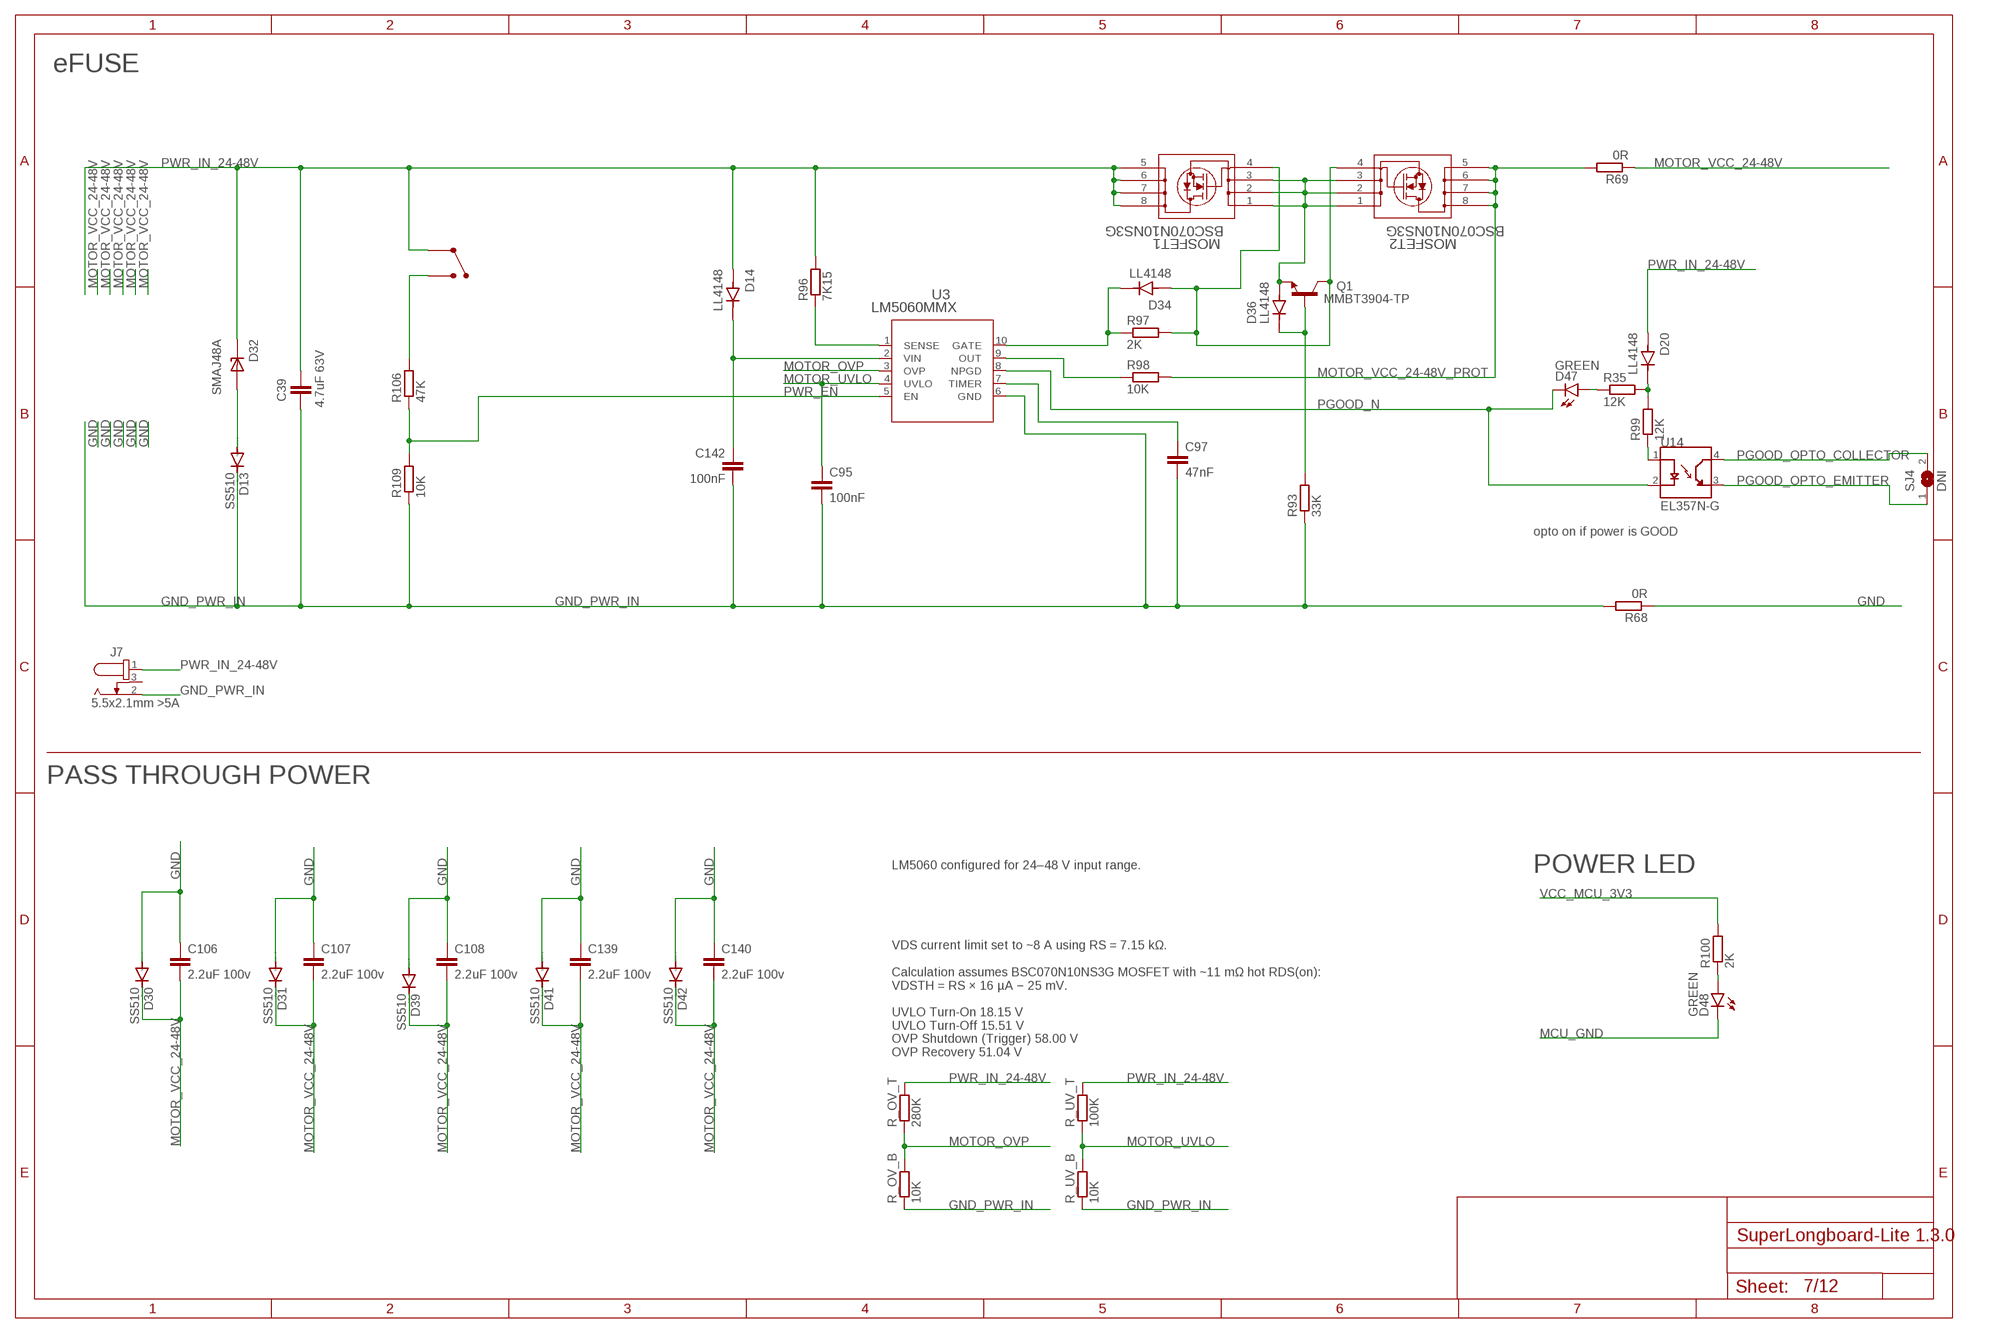
[diagram p6: schematic, sheet 7]

### Parts
C39  4.7uF 63V  C-EUC1210  [C1210]
C95  100nF  C-EUC0603  [C0603]
C97  47nF  C-EUC0805  [C0805]
C106  2.2uF 100v  C-EUC1210  [C1210]
C107  2.2uF 100v  C-EUC1210  [C1210]
C108  2.2uF 100v  C-EUC1210  [C1210]
C139  2.2uF 100v  C-EUC1210  [C1210]
C140  2.2uF 100v  C-EUC1210  [C1210]
C142  100nF  C-EUC0603  [C0603]
D13  SS510  DIODE-DO-214AC  [DO-214AC]
D14  LL4148  [DIO_LL4148]
D20  LL4148  [DIO_LL4148]
D30  SS510  DIODE-DO-214AC  [DO-214AC]
D31  SS510  DIODE-DO-214AC  [DO-214AC]
D32  SMAJ48A  SMAJ64A  [DIOM4325X250N]
D34  LL4148  [DIO_LL4148]
D36  LL4148  [DIO_LL4148]
D39  SS510  DIODE-DO-214AC  [DO-214AC]
D41  SS510  DIODE-DO-214AC  [DO-214AC]
D42  SS510  DIODE-DO-214AC  [DO-214AC]
D47  GREEN  LEDCHIP-LED0805  [CHIP-LED0805]
D48  GREEN  LEDCHIP-LED0805  [CHIP-LED0805]
J7  5.5x2.1mm >5A  694108301002  [694108301002]
MOSFET1  BSC070N10NS3G  [QNMOS_PRPAK5X6_HUA]
MOSFET2  BSC070N10NS3G  [QNMOS_PRPAK5X6_HUA]
Q1  MMBT3904-TP  [SOT95P237X125-3N]
R35  12K  R-EU_R0805  [R0805]
R68  0R  R-EU_R0603  [R0603]
R69  0R  R-EU_R0603  [R0603]
R93  33K  R-EU_R0805  [R0805]
R96  7K15  R-EU_R1206  [R1206]
R97  2K  R-EU_R0603  [R0603]
R98  10K  R-EU_R0603  [R0603]
R99  12K  R-EU_R0805  [R0805]
R100  2K  R-EU_R0603  [R0603]
R106  47K  R-EU_R0805  [R0805]
R109  10K  R-EU_R0603  [R0603]
R_OV_B  10K  R-EU_R0603  [R0603]
R_OV_T  280K  R-EU_R0805  [R0805]
R_UV_B  10K  R-EU_R0603  [R0603]
R_UV_T  100K  R-EU_R0805  [R0805]
SJ4  DNI  SJ  [SJ]
SW1  KCD11-BL  [KCD11-BL]
U3  LM5060MMX  LM5060MMX/NOPB  [MUB10A]
U14  EL357N-G  [OPTO_EL357N-G]

### Nets
GND: C106.1 C107.1 C108.1 C139.1 C140.1 D30.A D31.A D39.A D41.A D42.A R68.1 ; also sheet 1,2,3,4,6,8,9,10,11,12
GND_PWR_IN: C39.2 C95.2 C97.2 C142.2 D13.C J7.2 R68.2 R93.1 R109.1 R_OV_B.1 R_UV_B.1 U3.6(GND)
MCU_GND: D48.C ; also sheet 1,2,3,4,5,6,8,9,11,12
MOTOR_OVP: R_OV_B.2 R_OV_T.1 U3.3(OVP)
MOTOR_UVLO: C95.1 R_UV_B.2 R_UV_T.1 U3.4(UVLO)
MOTOR_VCC_24-48V: C106.2 C107.2 C108.2 C139.2 C140.2 D30.C D31.C D39.C D41.C D42.C R69.1 ; also sheet 2,4,8,11
MOTOR_VCC_24-48V_PROT: MOSFET2.5 MOSFET2.6 MOSFET2.7 MOSFET2.8 R69.2 R98.2
N$19: D47.A R35.1
N$60: R96.1 U3.1(SENSE)
N$61: D34.C R97.1 U3.10(GATE)
N$62: D36.C Q1.1(B) R93.2
N$63: R98.1 U3.9(OUT)
N$64: C97.1 U3.7(TIMER)
N$68: D20.C R35.2 R99.2
N$74: D34.A MOSFET1.4 MOSFET2.4 Q1.3(C) R97.2
N$76: C142.1 D14.C U3.2(VIN)
N$78: D13.A D32.A
N$135: R99.1 U14.1(A)
N$137: D36.A MOSFET1.1 MOSFET1.2 MOSFET1.3 MOSFET2.1 MOSFET2.2 MOSFET2.3 Q1.2(E)
N$138: D48.A R100.1
N$139: R106.2 SW1.P$2
PGOOD_N: D47.C U3.8(NPGD) U14.2(C)
PGOOD_OPTO_COLLECTOR: SJ4.2 U14.4(CT) ; also sheet 9
PGOOD_OPTO_EMITTER: SJ4.1 U14.3(ET) ; also sheet 9
PWR_EN: R106.1 R109.2 U3.5(EN)
PWR_IN_24-48V: C39.1 D14.A D20.A D32.C J7.1 MOSFET1.5 MOSFET1.6 MOSFET1.7 MOSFET1.8 R96.2 R_OV_T.2 R_UV_T.2 SW1.P$1
VCC_MCU_3V3: R100.2 ; also sheet 1,2,3,4,5,6,8,9,11,12
Unconnected: J7.3

### Notes on the sheet
- eFUSE
- opto on if power is GOOD
- PASS THROUGH POWER
- POWER LED
- LM5060 configured for 24–48 V input range.
  
  
  
  
  
  VDS current limit set to ~8 A using RS = 7.15 kΩ.
  
  Calculation assumes BSC070N10NS3G MOSFET with ~11 mΩ hot RDS(on):
  VDSTH = RS × 16 µA − 25 mV.
  
  UVLO Turn-On 18.15 V
  UVLO Turn-Off 15.51 V
  OVP Shutdown (Trigger) 58.00 V 
  OVP Recovery 51.04 V

## Sheet 8 of 12: POWER SUPPLY
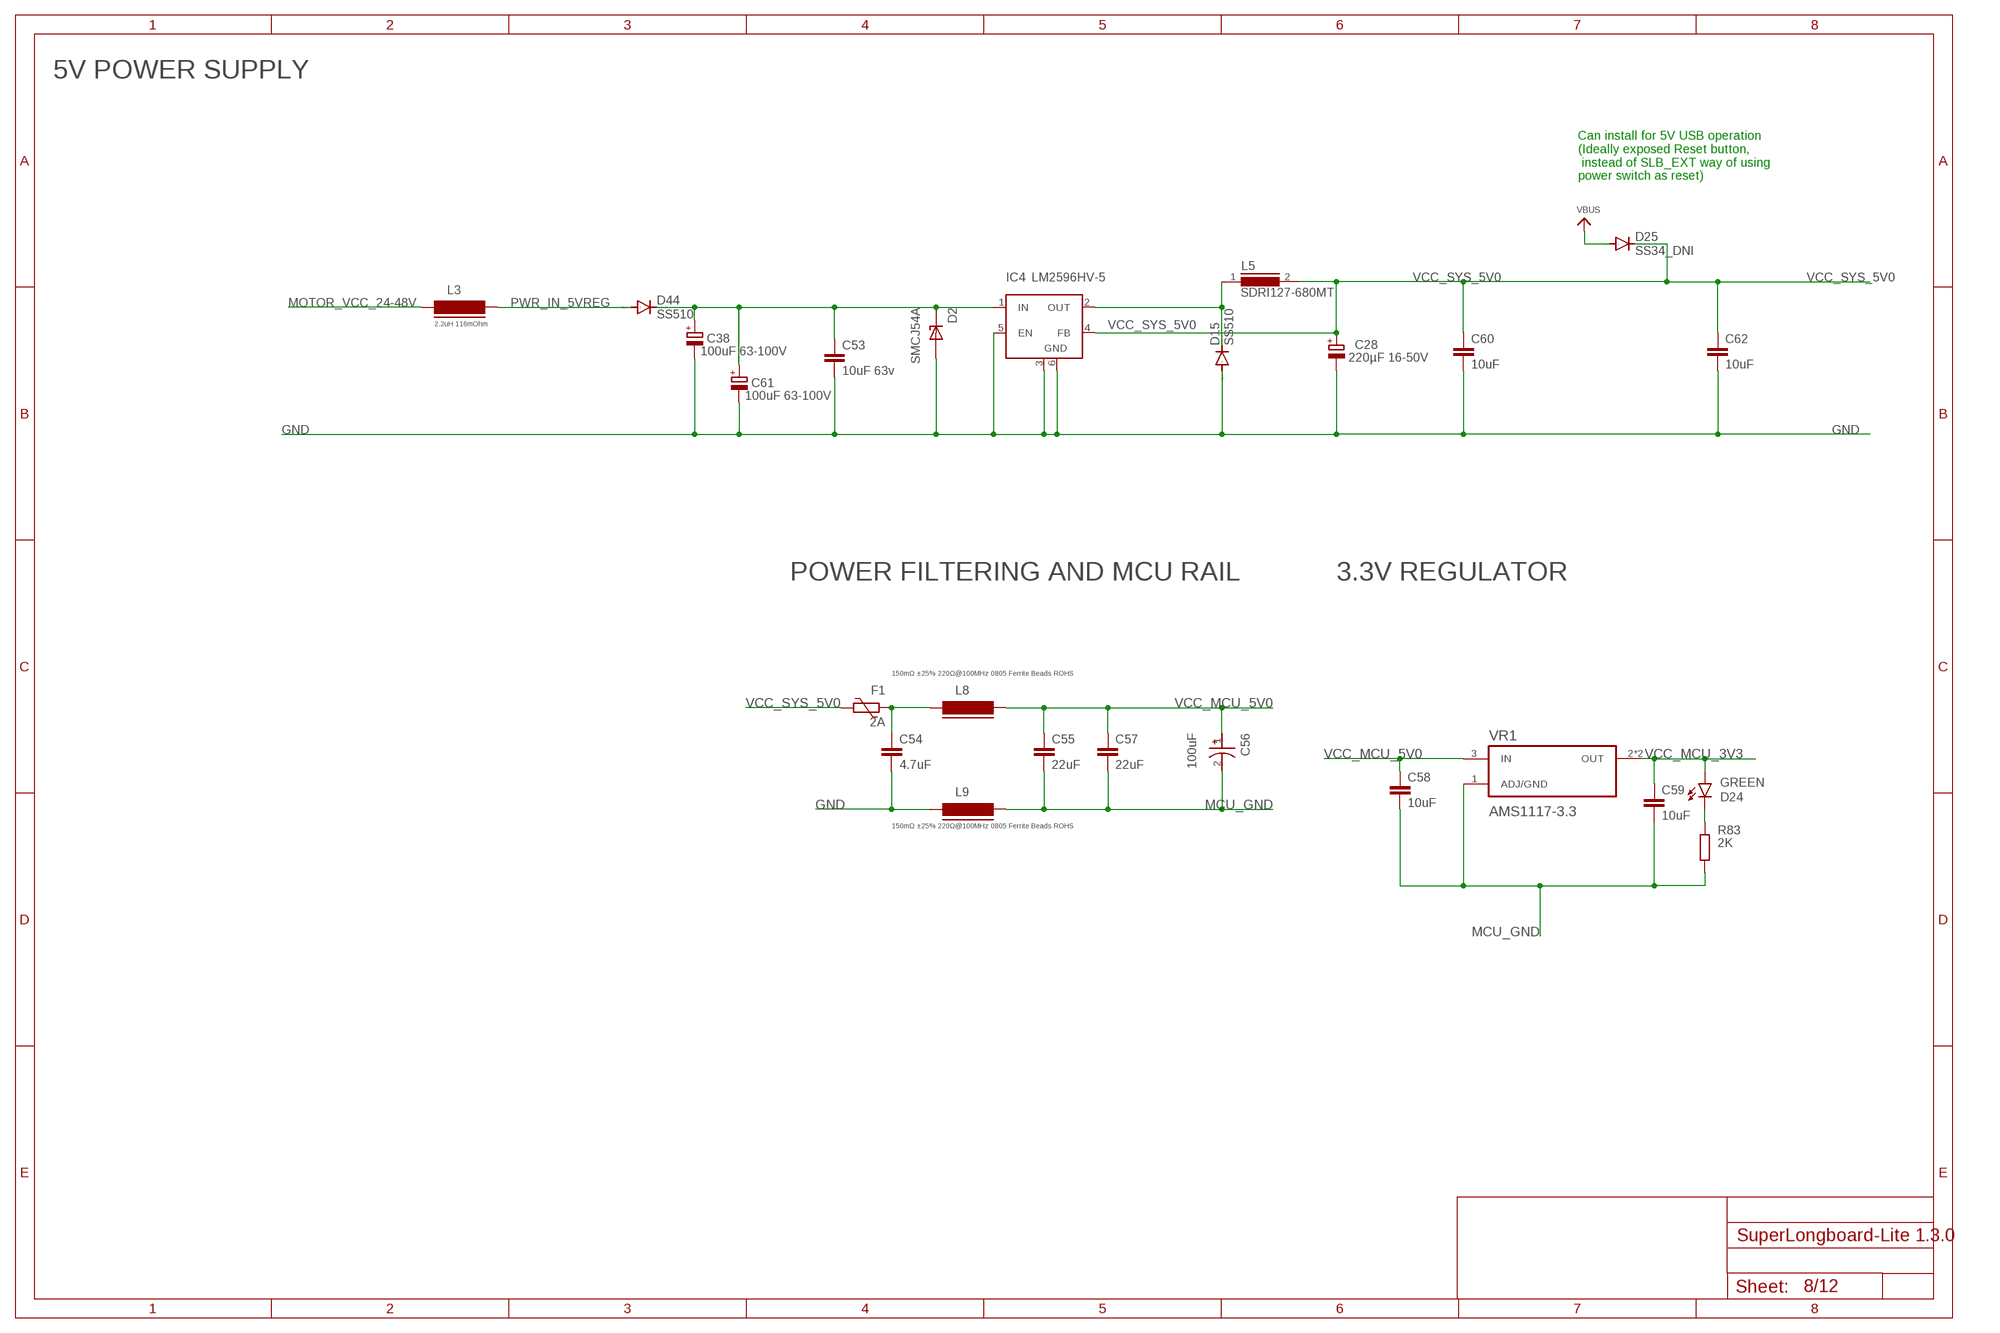
[diagram p7: schematic, sheet 8]

### Parts
C28  220µF 16-50V  CPOL-EUE  [PANASONIC_E]
C38  100uF 63-100V  CPOL-EUE  [PANASONIC_E]
C53  10uF 63v  C-EUC1206  [C1206]
C54  4.7uF  C-EUC0603  [C0603]
C55  22uF  C-EUC0603  [C0603]
C56  100uF  C-3528  [CAPMP3528X210N]
C57  22uF  C-EUC0603  [C0603]
C58  10uF  C-EUC1206  [C1206]
C59  10uF  C-EUC1206  [C1206]
C60  10uF  C-EUC1206  [C1206]
C61  100uF 63-100V  CPOL-EUE  [PANASONIC_E]
C62  10uF  C-EUC1206  [C1206]
D2  SMCJ54A  [DIOM7959X262N]
D15  SS510  DIODE-DO-214AC  [DO-214AC]
D24  GREEN  LEDCHIP-LED0805  [CHIP-LED0805]
D25  SS34_DNI  DIODE-DO-214AC  [DO-214AC]
D44  SS510  DIODE-DO-214AC  [DO-214AC]
F1  2A  1206L050  [1206L]
IC4  LM2596HV-5  LM2596S  [TO263-5]
L3  2.2uH 116mOhm  FERRITE-0805  [FB805]
L5  SDRI127-680MT  DR127  [DR127]
L8  150mΩ ±25% 220Ω@100MHz 0805 Ferrite Beads ROHS  FERRITE-0805  [FB805]
L9  150mΩ ±25% 220Ω@100MHz 0805 Ferrite Beads ROHS  FERRITE-0805  [FB805]
R83  2K  R-EU_R0603  [R0603]
VR1  AMS1117-3.3  [AMS1117-3.3]

### Nets
+24V1: C38.+ C53.1 C61.+ D2.C D44.C IC4.1(IN)
GND: C28.- C38.- C53.2 C54.2 C60.2 C61.- C62.2 D2.A D15.A IC4.3(GND) IC4.5(EN) IC4.6(GND) L9.1 ; also sheet 1,2,3,4,6,7,9,10,11,12
MCU_GND: C55.2 C56.2 C57.2 C58.2 C59.2 L9.2 R83.2 VR1.1(ADJ/GND) ; also sheet 1,2,3,4,5,6,7,9,11,12
MOTOR_VCC_24-48V: L3.1 ; also sheet 2,4,7,11
N$136: D24.C R83.1
N$164: D15.C IC4.2(OUT) L5.1
PWR_IN_5VREG: D44.A L3.2
SYS5V: C54.1 F1.2 L8.1
VBUS: D25.A ; also sheet 1
VCC_MCU_3V3: C59.1 D24.A VR1.2(OUT) VR1.4(OUT) ; also sheet 1,2,3,4,5,6,7,9,11,12
VCC_MCU_5V0: C55.1 C56.1 C57.1 C58.1 L8.2 VR1.3(IN)
VCC_SYS_5V0: C28.+ C60.1 C62.1 D25.C F1.1 IC4.4(FB) L5.2 ; also sheet 2,3,4,6,9,10,11,12

### Notes on the sheet
- 5V POWER SUPPLY
- Can install for 5V USB operation 
  (Ideally exposed Reset button,
   instead of SLB_EXT way of using 
  power switch as reset)
- POWER FILTERING AND MCU RAIL | 3.3V REGULATOR

## Sheet 9 of 12: E-STOP
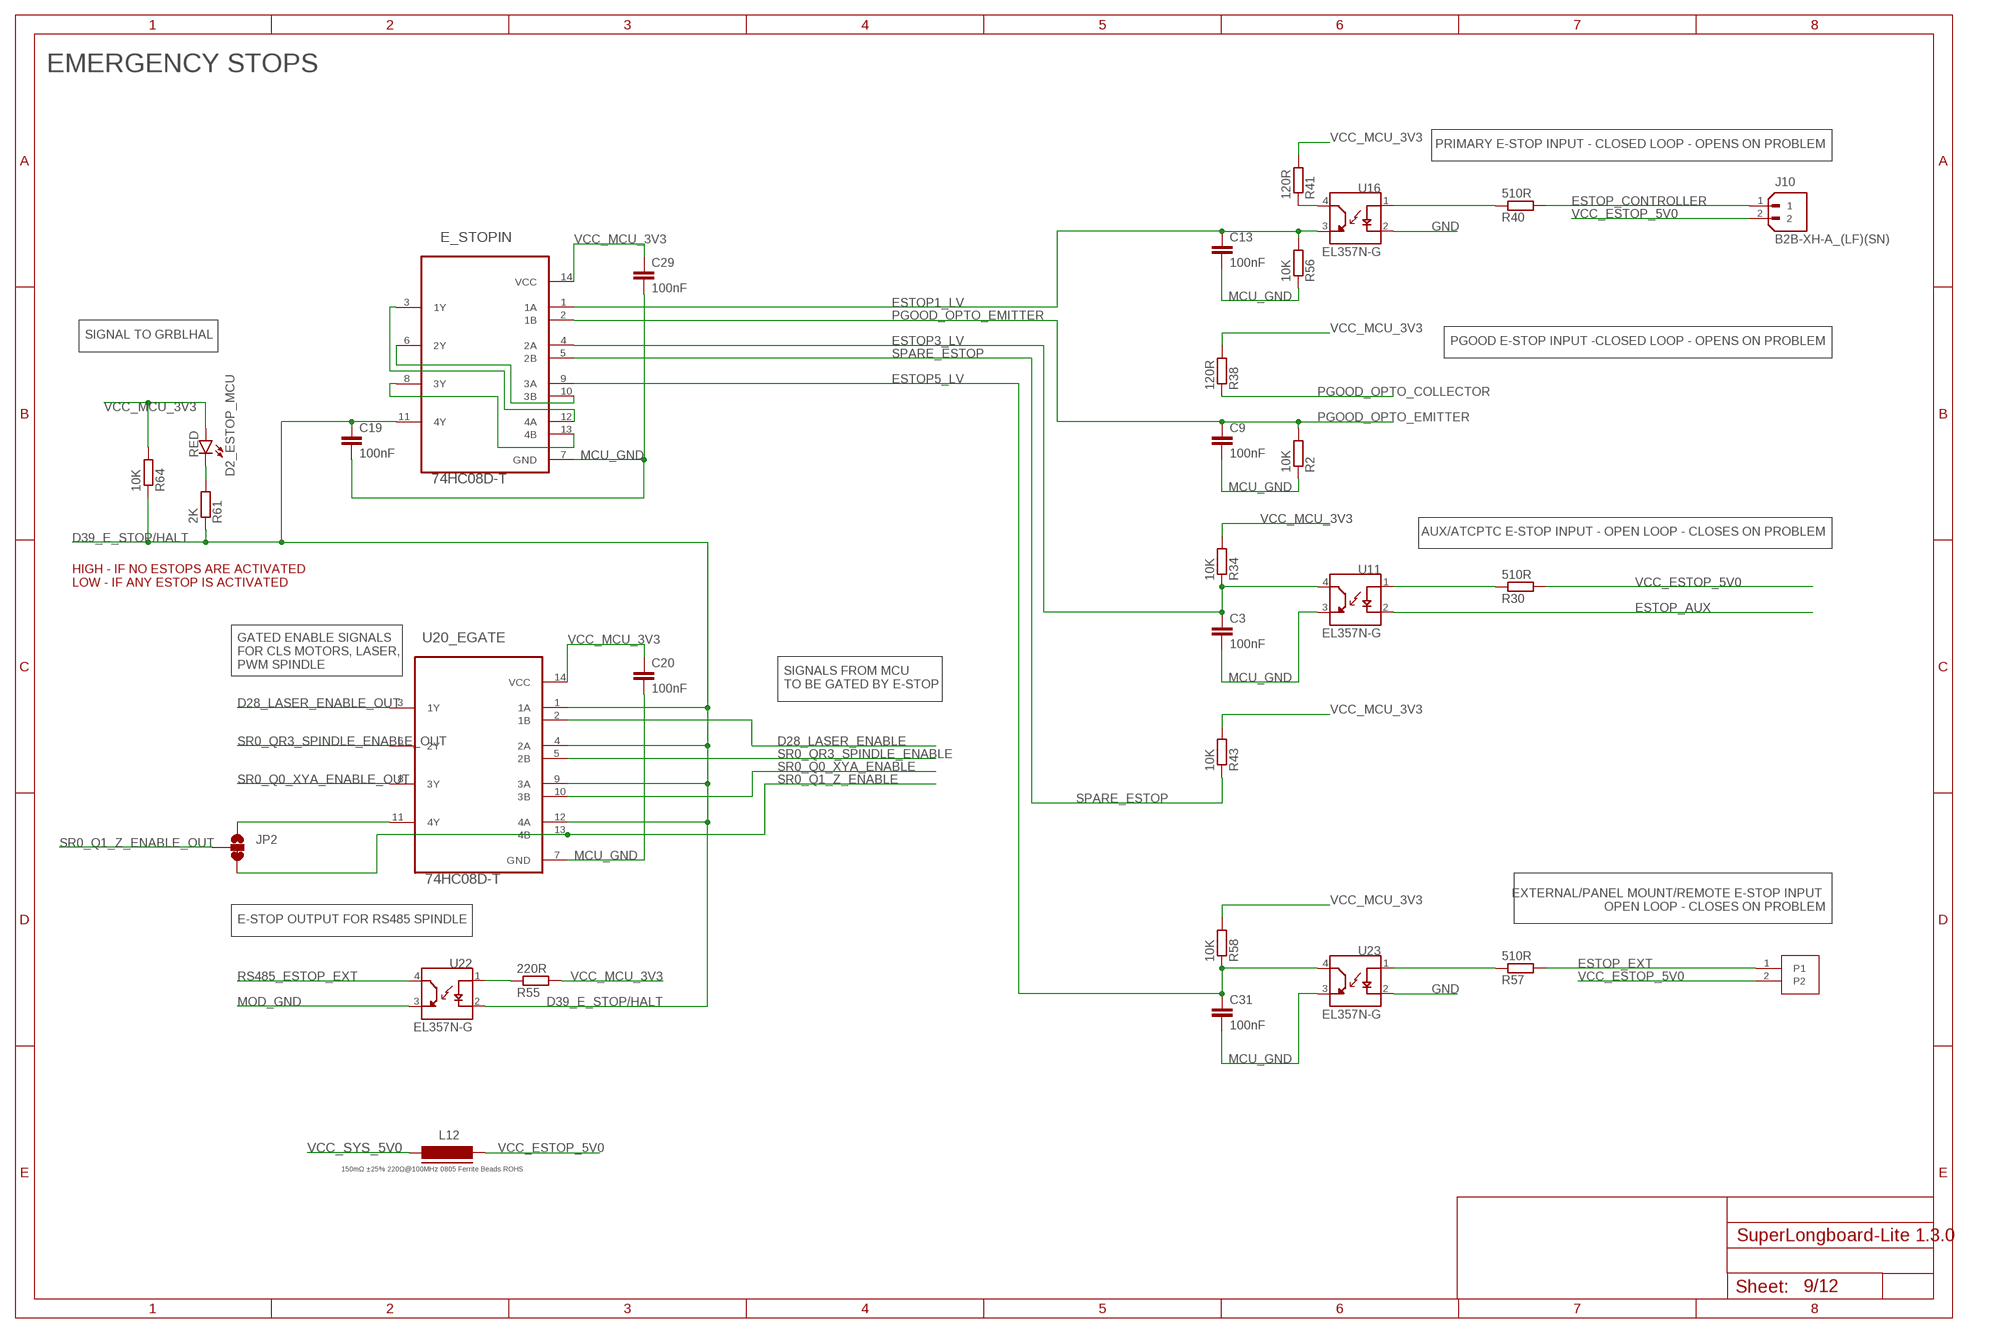
[diagram p8: schematic, sheet 9]

### Parts
C3  100nF  C-EUC0603  [C0603]
C9  100nF  C-EUC0603  [C0603]
C13  100nF  C-EUC0603  [C0603]
C19  100nF  C-EUC0603  [C0603]
C20  100nF  C-EUC0603  [C0603]
C29  100nF  C-EUC0603  [C0603]
C31  100nF  C-EUC0603  [C0603]
D2_ESTOP_MCU  RED  LEDCHIP-LED0805  [CHIP-LED0805]
E_STOPIN  74HC08D-T  [SOIC127P600X175-14N]
J10  B2B-XH-A_(LF)(SN)  [JST_B2B-XH-A_(LF)(SN)]
J11  DB2ERC-3.81-2P-BK  1803277  [MC1.5/2-G-3.81]
JP2  DNI  JUMPER-SMT_3_1-NC_TRACE_SILK  [SMT-JUMPER_3_1-NC_TRACE_SILK]
L12  150mΩ ±25% 220Ω@100MHz 0805 Ferrite Beads ROHS  FERRITE-0805  [FB805]
R2  10K  R-EU_R0603  [R0603]
R30  510R  R-EU_R0603  [R0603]
R34  10K  R-EU_R0603  [R0603]
R38  120R  R-EU_R0603  [R0603]
R40  510R  R-EU_R0603  [R0603]
R41  120R  R-EU_R0603  [R0603]
R43  10K  R-EU_R0603  [R0603]
R55  220R  R-EU_R0603  [R0603]
R56  10K  R-EU_R0603  [R0603]
R57  510R  R-EU_R0603  [R0603]
R58  10K  R-EU_R0603  [R0603]
R61  2K  R-EU_R0603  [R0603]
R64  10K  R-EU_R0603  [R0603]
U11  EL357N-G  [OPTO_EL357N-G]
U16  EL357N-G  [OPTO_EL357N-G]
U20_EGATE  74HC08D-T  [SOIC127P600X175-14N]
U22  EL357N-G  [OPTO_EL357N-G]
U23  EL357N-G  [OPTO_EL357N-G]

### Nets
D28_LASER_ENABLE: U20_EGATE.2(1B) ; also sheet 1
D28_LASER_ENABLE_OUT: U20_EGATE.3(1Y) ; also sheet 5
D39_E_STOP/HALT: C19.1 E_STOPIN.11(4Y) R61.1 R64.1 U20_EGATE.1(1A) U20_EGATE.4(2A) U20_EGATE.9(3A) U20_EGATE.12(4A) U22.2(C) ; also sheet 1
ESTOP1_LV: C13.1 E_STOPIN.1(1A) R56.2 U16.3(ET)
ESTOP3_LV: C3.1 E_STOPIN.4(2A) R34.1 U11.4(CT)
ESTOP5_LV: C31.1 E_STOPIN.9(3A) R58.1 U23.4(CT)
ESTOP_AUX: U11.2(C) ; also sheet 11
ESTOP_CONTROLLER: J10.1 R40.2
ESTOP_EXT: J11.1 R57.2
GND: U16.2(C) U23.2(C) ; also sheet 1,2,3,4,6,7,8,10,11,12
MCU_GND: C3.2 C9.2 C13.2 C19.2 C20.2 C29.2 C31.2 E_STOPIN.7(GND) R2.1 R56.1 U11.3(ET) U20_EGATE.7(GND) U23.3(ET) ; also sheet 1,2,3,4,5,6,7,8,11,12
MOD_GND: U22.3(ET) ; also sheet 5,6
N$2: R30.1 U11.1(A)
N$6: R55.1 U22.1(A)
N$22: R40.1 U16.1(A)
N$26: E_STOPIN.6(2Y) E_STOPIN.10(3B)
N$27: E_STOPIN.3(1Y) E_STOPIN.12(4A)
N$28: E_STOPIN.8(3Y) E_STOPIN.13(4B)
N$30: R41.1 U16.4(CT)
N$31: R57.1 U23.1(A)
N$32: D2_ESTOP_MCU.C R61.2
N$33: JP2.1 U20_EGATE.11(4Y)
PGOOD_OPTO_COLLECTOR: R38.1 ; also sheet 7
PGOOD_OPTO_EMITTER: C9.1 E_STOPIN.2(1B) R2.2 ; also sheet 7
RS485_ESTOP_EXT: U22.4(CT) ; also sheet 6
SPARE_ESTOP: E_STOPIN.5(2B) R43.1
SR0_Q0_XYA_ENABLE: U20_EGATE.10(3B) ; also sheet 11
SR0_Q0_XYA_ENABLE_OUT: U20_EGATE.8(3Y) ; also sheet 3
SR0_Q1_Z_ENABLE: JP2.3 U20_EGATE.13(4B) ; also sheet 11
SR0_Q1_Z_ENABLE_OUT: JP2.2 ; also sheet 3
SR0_QR3_SPINDLE_ENABLE: U20_EGATE.5(2B) ; also sheet 11
SR0_QR3_SPINDLE_ENABLE_OUT: U20_EGATE.6(2Y) ; also sheet 5
VCC_ESTOP_5V0: J10.2 J11.2 L12.1 R30.2
VCC_MCU_3V3: C20.1 C29.1 D2_ESTOP_MCU.A E_STOPIN.14(VCC) R34.2 R38.2 R41.2 R43.2 R55.2 R58.2 R64.2 U20_EGATE.14(VCC) ; also sheet 1,2,3,4,5,6,7,8,11,12
VCC_SYS_5V0: L12.2 ; also sheet 2,3,4,6,8,10,11,12

### Notes on the sheet
- EMERGENCY STOPS
- PRIMARY E-STOP INPUT - CLOSED LOOP - OPENS ON PROBLEM
- SIGNAL TO GRBLHAL
- PGOOD E-STOP INPUT -CLOSED LOOP - OPENS ON PROBLEM
- AUX/ATCPTC E-STOP INPUT - OPEN LOOP - CLOSES ON PROBLEM
- HIGH - IF NO ESTOPS ARE ACTIVATED
  LOW - IF ANY ESTOP IS ACTIVATED
- GATED ENABLE SIGNALS
  FOR CLS MOTORS, LASER, 
  PWM SPINDLE
- SIGNALS FROM MCU 
  TO BE GATED BY E-STOP
- EXTERNAL/PANEL MOUNT/REMOTE E-STOP INPUT 
  OPEN LOOP - CLOSES ON PROBLEM
- E-STOP OUTPUT FOR RS485 SPINDLE

## Sheet 10 of 12: NEOPIXEL
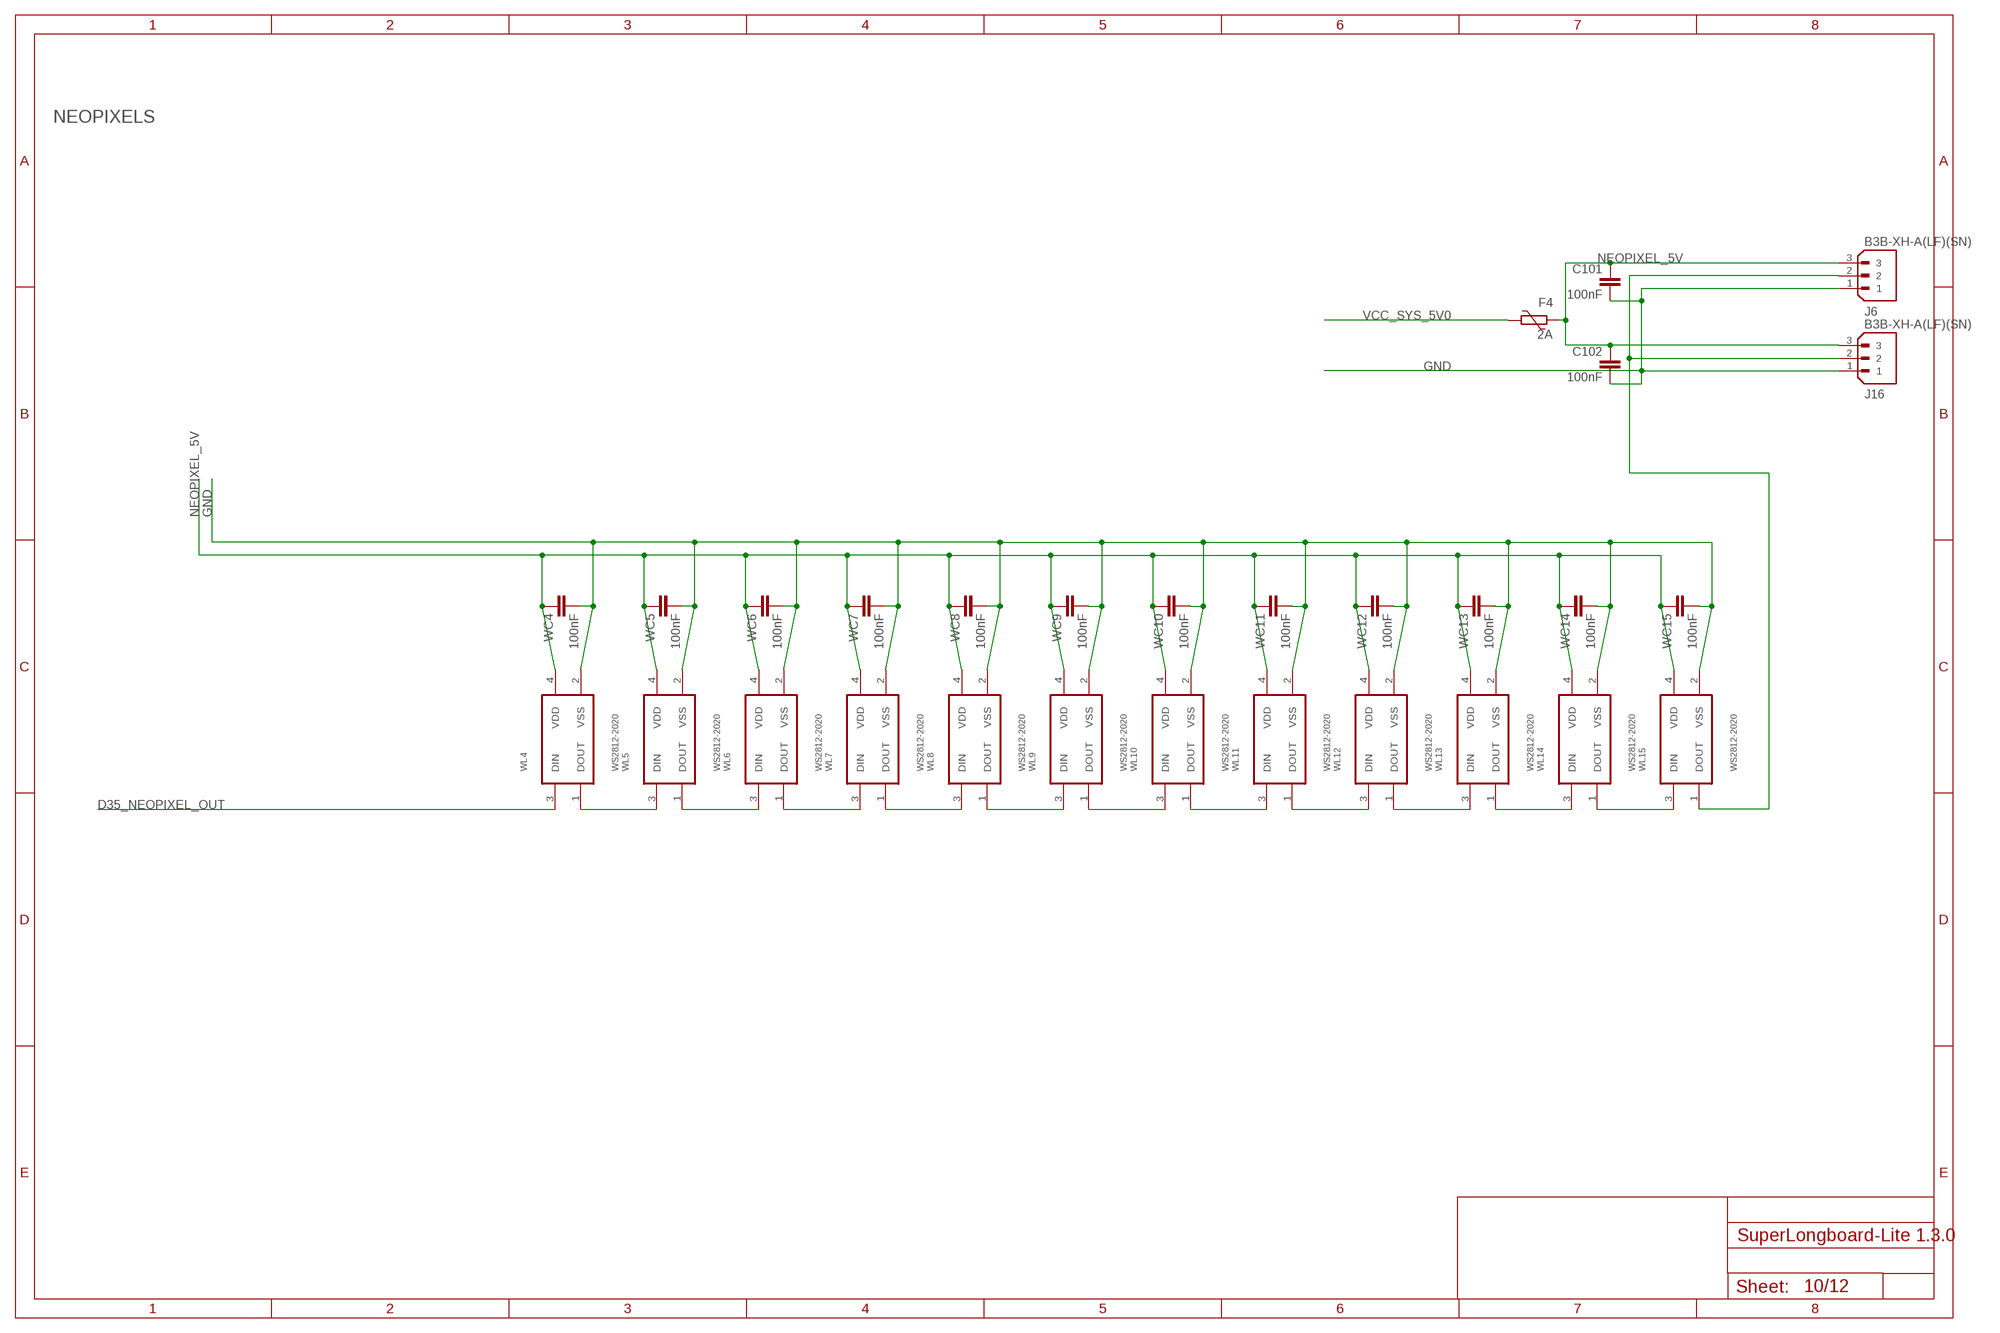
[diagram p9: schematic, sheet 10]

### Parts
C101  100nF  C-EUC0603  [C0603]
C102  100nF  C-EUC0603  [C0603]
F4  2A  1206L050  [1206L]
J6  B3B-XH-A(LF)(SN)  [JST_B3B-XH-A(LF)(SN)]
J16  B3B-XH-A(LF)(SN)  [JST_B3B-XH-A(LF)(SN)]
WC4  100nF  C-EUC0603  [C0603]
WC5  100nF  C-EUC0603  [C0603]
WC6  100nF  C-EUC0603  [C0603]
WC7  100nF  C-EUC0603  [C0603]
WC8  100nF  C-EUC0603  [C0603]
WC9  100nF  C-EUC0603  [C0603]
WC10  100nF  C-EUC0603  [C0603]
WC11  100nF  C-EUC0603  [C0603]
WC12  100nF  C-EUC0603  [C0603]
WC13  100nF  C-EUC0603  [C0603]
WC14  100nF  C-EUC0603  [C0603]
WC15  100nF  C-EUC0603  [C0603]
WL4  WS2812-2020  [LED_WS2812-2020]
WL5  WS2812-2020  [LED_WS2812-2020]
WL6  WS2812-2020  [LED_WS2812-2020]
WL7  WS2812-2020  [LED_WS2812-2020]
WL8  WS2812-2020  [LED_WS2812-2020]
WL9  WS2812-2020  [LED_WS2812-2020]
WL10  WS2812-2020  [LED_WS2812-2020]
WL11  WS2812-2020  [LED_WS2812-2020]
WL12  WS2812-2020  [LED_WS2812-2020]
WL13  WS2812-2020  [LED_WS2812-2020]
WL14  WS2812-2020  [LED_WS2812-2020]
WL15  WS2812-2020  [LED_WS2812-2020]

### Nets
D35_NEOPIXEL_OUT: WL4.3(DIN) ; also sheet 3
GND: C101.2 C102.2 J6.1 J16.1 WC4.2 WC5.2 WC6.2 WC7.2 WC8.2 WC9.2 WC10.2 WC11.2 WC12.2 WC13.2 WC14.2 WC15.2 WL4.2(VSS) WL5.2(VSS) WL6.2(VSS) WL7.2(VSS) WL8.2(VSS) WL9.2(VSS) WL10.2(VSS) WL11.2(VSS) WL12.2(VSS) WL13.2(VSS) WL14.2(VSS) WL15.2(VSS) ; also sheet 1,2,3,4,6,7,8,9,11,12
N$149: WL4.1(DOUT) WL5.3(DIN)
N$150: WL5.1(DOUT) WL6.3(DIN)
N$151: WL6.1(DOUT) WL7.3(DIN)
N$152: WL7.1(DOUT) WL8.3(DIN)
N$154: WL8.1(DOUT) WL9.3(DIN)
N$155: WL9.1(DOUT) WL10.3(DIN)
N$156: WL10.1(DOUT) WL11.3(DIN)
N$157: WL11.1(DOUT) WL12.3(DIN)
N$158: WL12.1(DOUT) WL13.3(DIN)
N$159: WL13.1(DOUT) WL14.3(DIN)
N$160: WL14.1(DOUT) WL15.3(DIN)
N$161: J6.2 J16.2 WL15.1(DOUT)
NEOPIXEL_5V: C101.1 C102.1 F4.2 J6.3 J16.3 WC4.1 WC5.1 WC6.1 WC7.1 WC8.1 WC9.1 WC10.1 WC11.1 WC12.1 WC13.1 WC14.1 WC15.1 WL4.4(VDD) WL5.4(VDD) WL6.4(VDD) WL7.4(VDD) WL8.4(VDD) WL9.4(VDD) WL10.4(VDD) WL11.4(VDD) WL12.4(VDD) WL13.4(VDD) WL14.4(VDD) WL15.4(VDD)
VCC_SYS_5V0: F4.1 ; also sheet 2,3,4,6,8,9,11,12

### Notes on the sheet
- NEOPIXELS

## Sheet 11 of 12: EXPANSION
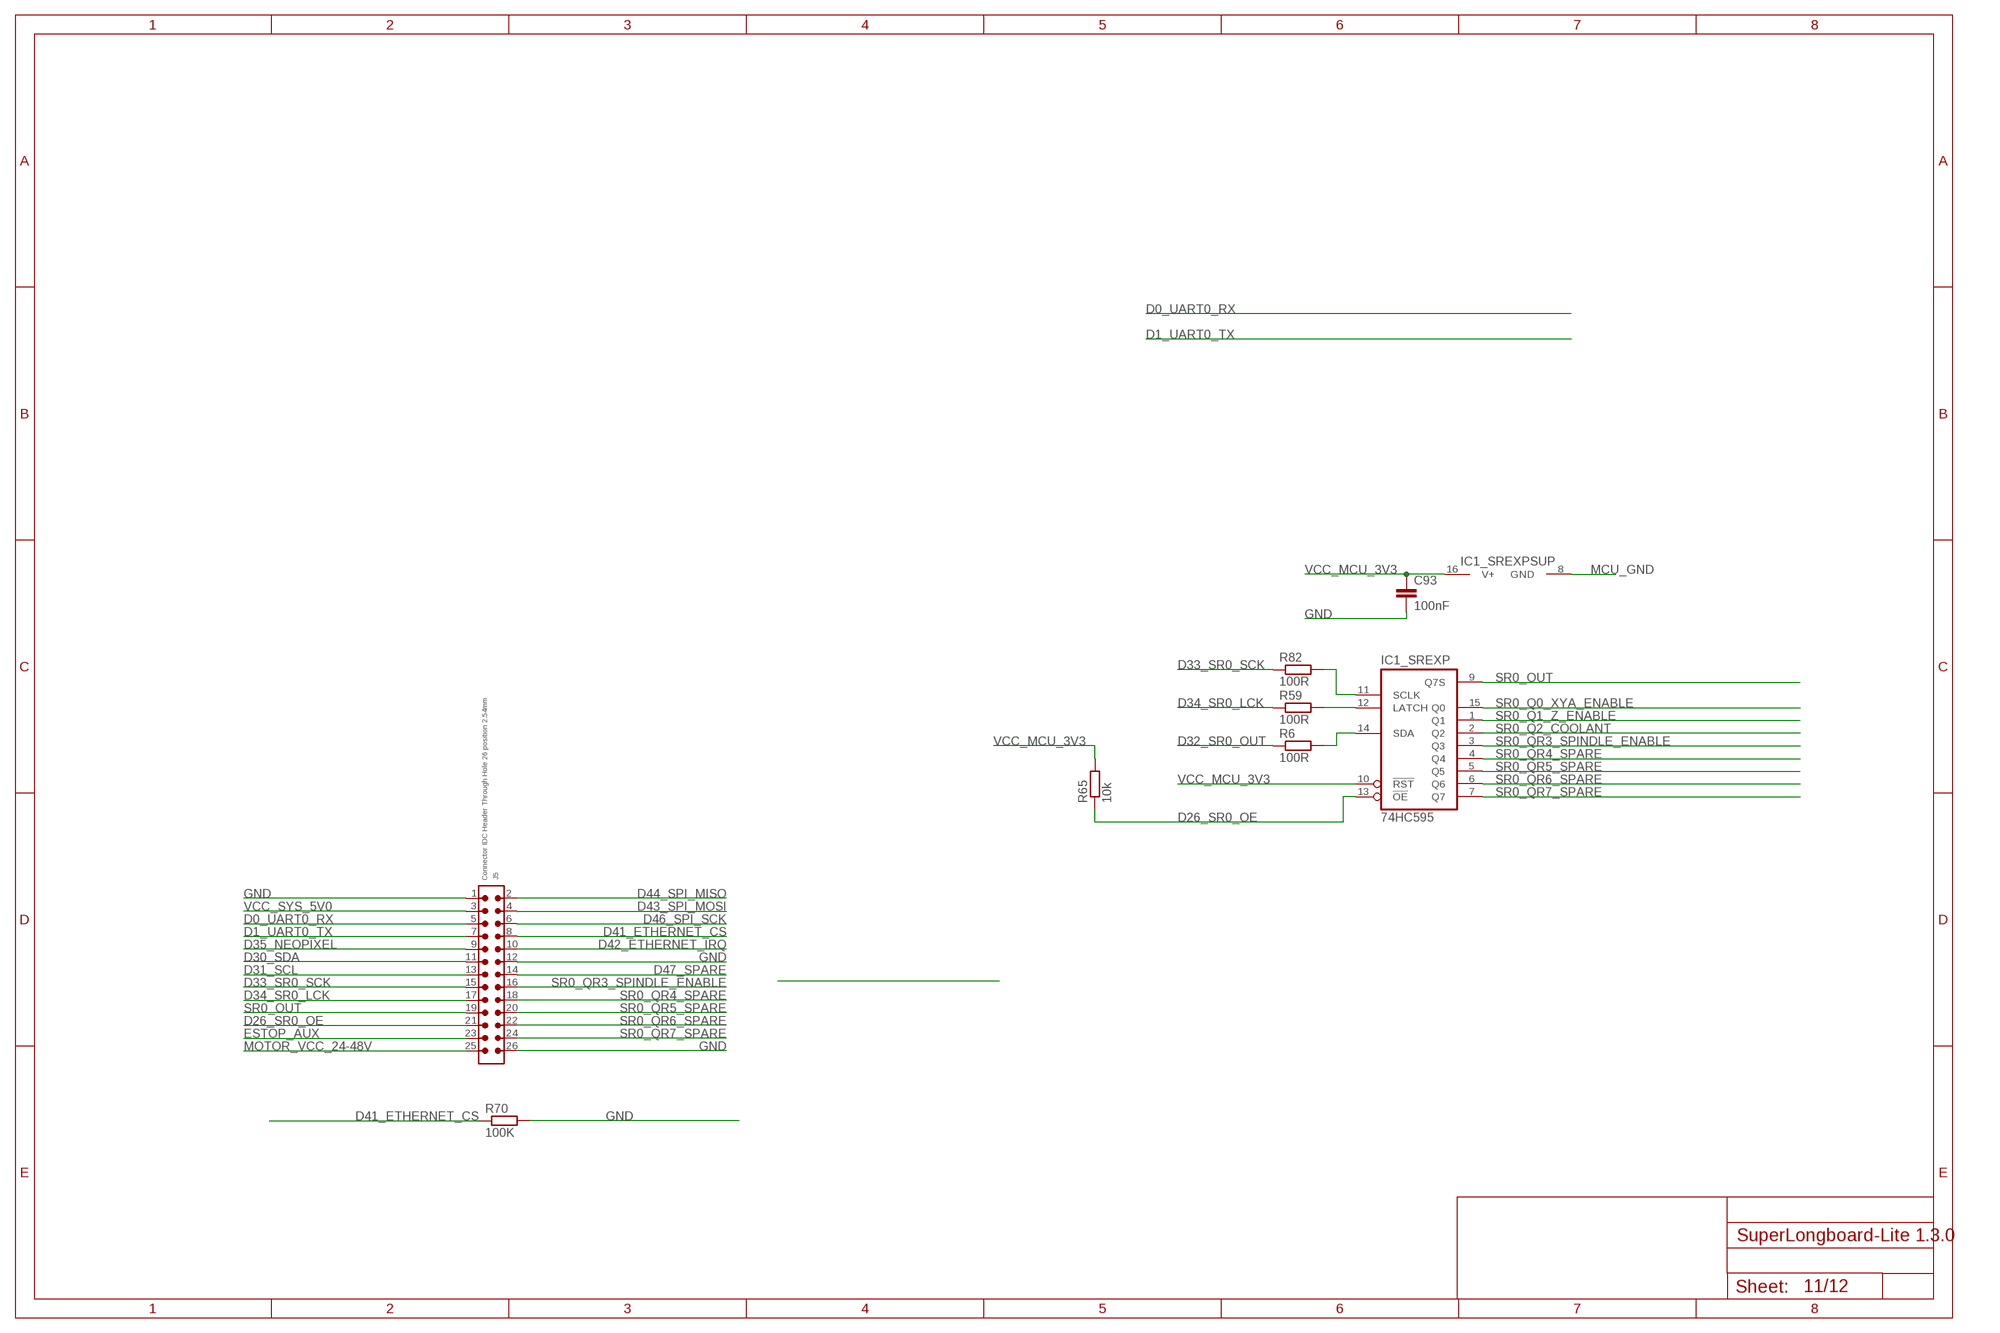
[diagram p10: schematic, sheet 11]

### Parts
C93  100nF  C-EUC0603  [C0603]
IC1_SREXP  74HC595  IC_74HC595-SOIC-16  [SOIC-16]
J5  Connector IDC Header Through Hole 26 position 2.54mm  6120XX21621_61202621621  [61202621621]
R6  100R  R-EU_R0603  [R0603]
R59  100R  R-EU_R0603  [R0603]
R65  10k  R-EU_R0603  [R0603]
R70  100K  R-EU_R0805  [R0805]
R82  100R  R-EU_R0603  [R0603]

### Nets
D0_UART0_RX: J5.5 ; also sheet 1
D1_UART0_TX: J5.7 ; also sheet 1
D26_SR0_OE: IC1_SREXP.13(!OE) J5.21 R65.1 ; also sheet 1
D30_SDA: J5.11 ; also sheet 1
D31_SCL: J5.13 ; also sheet 1
D32_SR0_OUT: R6.1 ; also sheet 1
D33_SR0_SCK: J5.15 R82.1 ; also sheet 1
D34_SR0_LCK: J5.17 R59.1 ; also sheet 1
D35_NEOPIXEL: J5.9 ; also sheet 1,3
D41_ETHERNET_CS: J5.8 R70.1 ; also sheet 1
D42_ETHERNET_IRQ: J5.10 ; also sheet 1
D43_SPI_MOSI: J5.4 ; also sheet 1
D44_SPI_MISO: J5.2 ; also sheet 1
D46_SPI_SCK: J5.6 ; also sheet 1
D47_SPARE: J5.14 ; also sheet 1
ESTOP_AUX: J5.23 ; also sheet 9
GND: C93.2 J5.1 J5.12 J5.26 R70.2 ; also sheet 1,2,3,4,6,7,8,9,10,12
MCU_GND: IC1_SREXP.8(GND) ; also sheet 1,2,3,4,5,6,7,8,9,12
MOTOR_VCC_24-48V: J5.25 ; also sheet 2,4,7,8
N$47: IC1_SREXP.12(LATCH) R59.2
N$56: IC1_SREXP.11(SCLK) R82.2
N$57: IC1_SREXP.14(SDA) R6.2
SR0_OUT: IC1_SREXP.9(Q7S) J5.19
SR0_Q0_XYA_ENABLE: IC1_SREXP.15(Q0) ; also sheet 9
SR0_Q1_Z_ENABLE: IC1_SREXP.1(Q1) ; also sheet 9
SR0_Q2_COOLANT: IC1_SREXP.2(Q2) ; also sheet 4
SR0_QR3_SPINDLE_ENABLE: IC1_SREXP.3(Q3) J5.16 ; also sheet 9
SR0_QR4_SPARE: IC1_SREXP.4(Q4) J5.18
SR0_QR5_SPARE: IC1_SREXP.5(Q5) J5.20
SR0_QR6_SPARE: IC1_SREXP.6(Q6) J5.22
SR0_QR7_SPARE: IC1_SREXP.7(Q7) J5.24
VCC_MCU_3V3: C93.1 IC1_SREXP.10(!RST) IC1_SREXP.16(V+) R65.2 ; also sheet 1,2,3,4,5,6,7,8,9,12
VCC_SYS_5V0: J5.3 ; also sheet 2,3,4,6,8,9,10,12

## Sheet 12 of 12: CLOSED LOOP HOMING
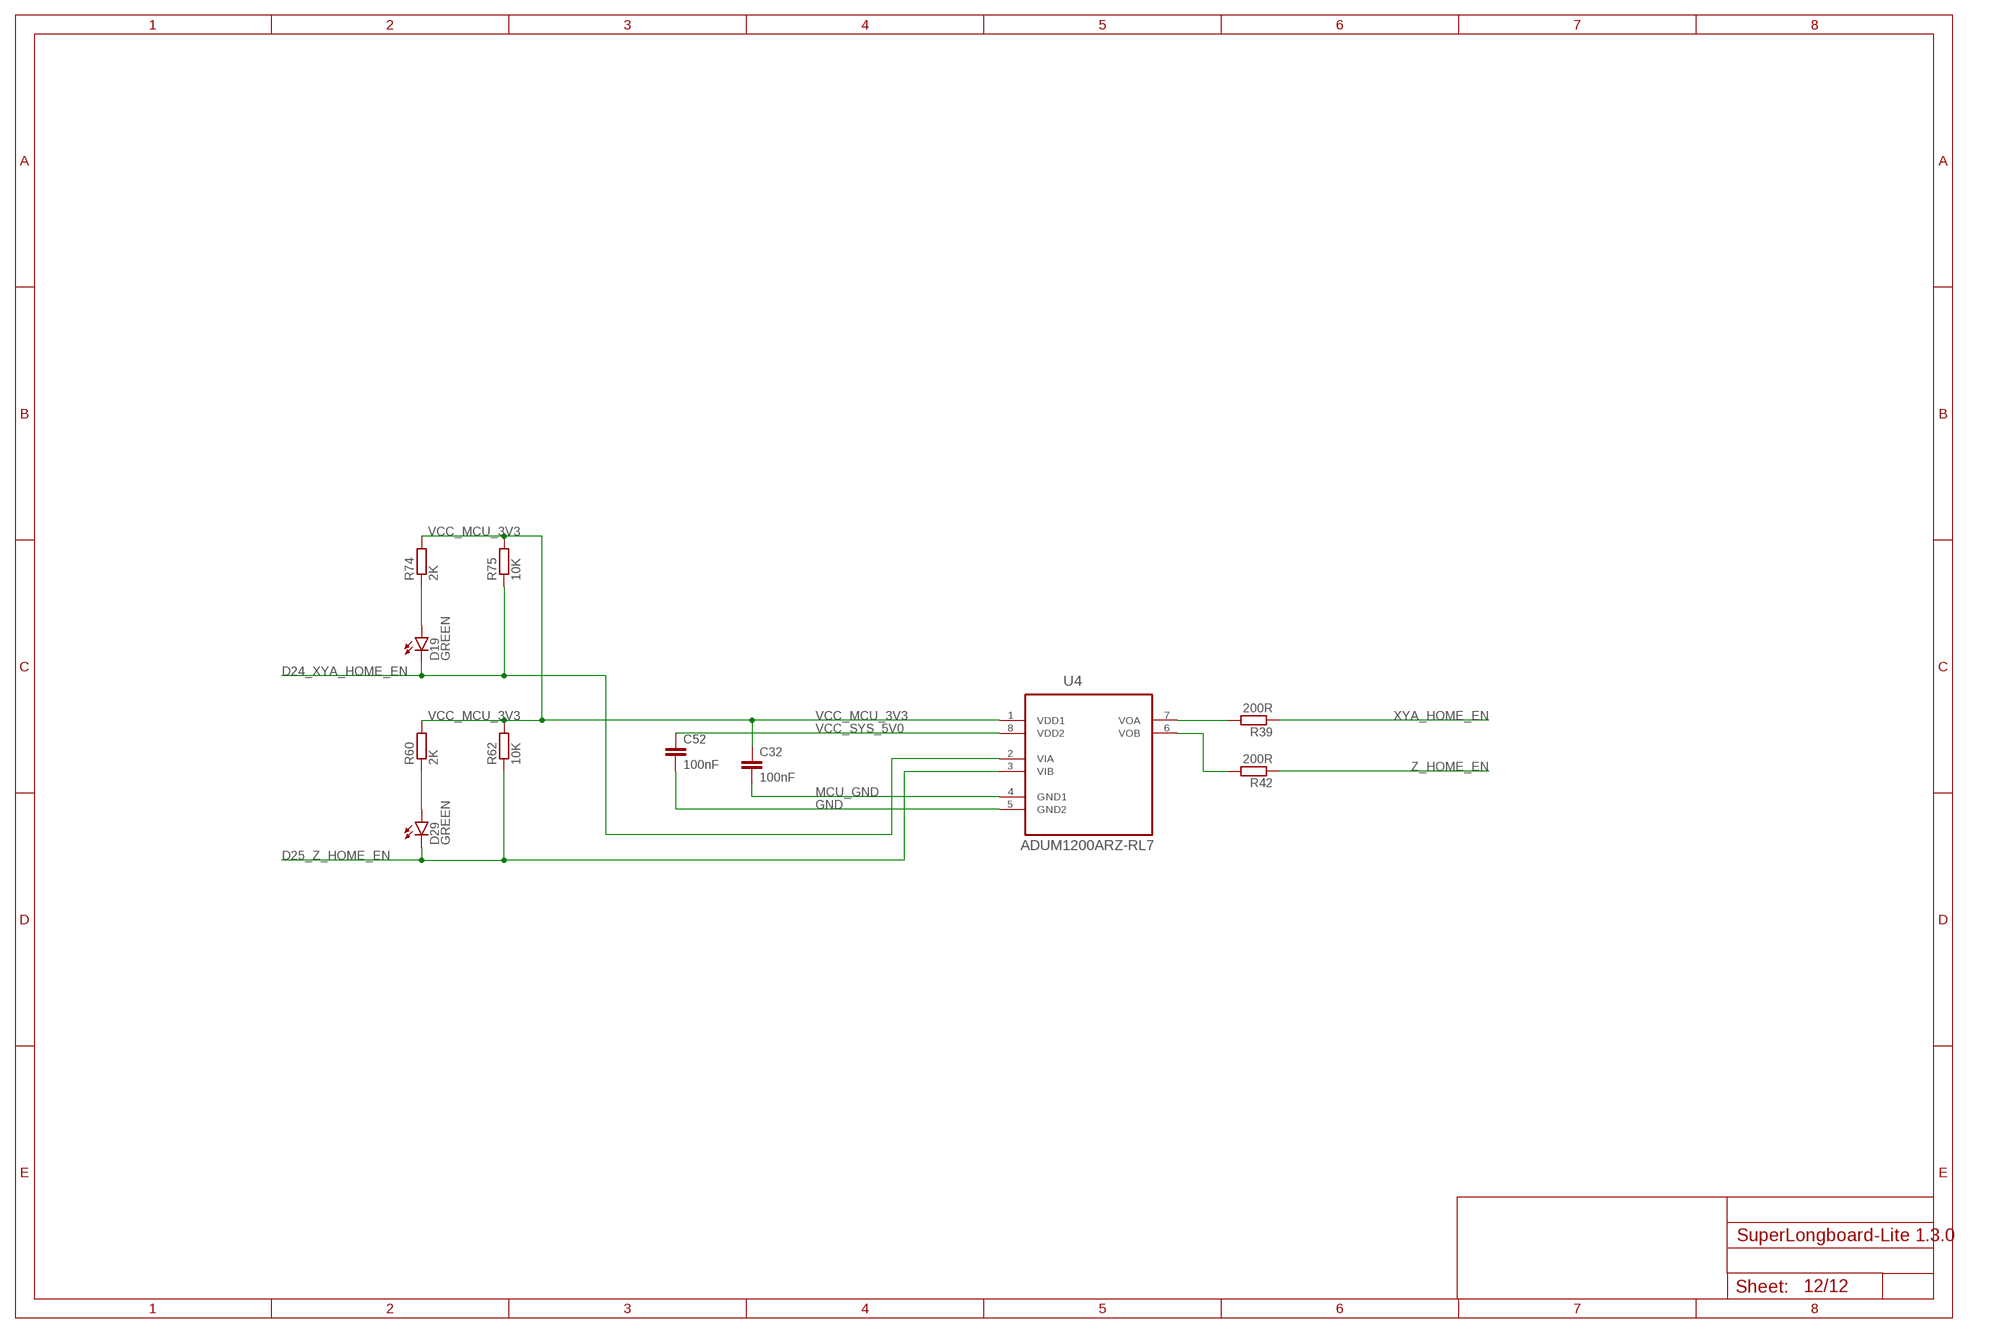
[diagram p11: schematic, sheet 12]

### Parts
C32  100nF  C-EUC0603K  [C0603K]
C52  100nF  C-EUC0603K  [C0603K]
D19  GREEN  LEDCHIP-LED0805  [CHIP-LED0805]
D29  GREEN  LEDCHIP-LED0805  [CHIP-LED0805]
R39  200R  R-EU_R0603  [R0603]
R42  200R  R-EU_R0603  [R0603]
R60  2K  R-EU_R0603  [R0603]
R62  10K  R-EU_R0603  [R0603]
R74  2K  R-EU_R0603  [R0603]
R75  10K  R-EU_R0603  [R0603]
U4  ADUM1200ARZ-RL7  [SOIC127P600X175-8N]

### Nets
D24_XYA_HOME_EN: D19.C R75.1 U4.2(VIA) ; also sheet 1
D25_Z_HOME_EN: D29.C R62.1 U4.3(VIB) ; also sheet 1
GND: C52.2 U4.5(GND2) ; also sheet 1,2,3,4,6,7,8,9,10,11
MCU_GND: C32.2 U4.4(GND1) ; also sheet 1,2,3,4,5,6,7,8,9,11
N$34: R39.2 U4.7(VOA)
N$35: R42.2 U4.6(VOB)
N$36: D29.A R60.1
N$52: D19.A R74.1
VCC_MCU_3V3: C32.1 R60.2 R62.2 R74.2 R75.2 U4.1(VDD1) ; also sheet 1,2,3,4,5,6,7,8,9,11
VCC_SYS_5V0: C52.1 U4.8(VDD2) ; also sheet 2,3,4,6,8,9,10,11
XYA_HOME_EN: R39.1 ; also sheet 2
Z_HOME_EN: R42.1 ; also sheet 2